# EAGLE board argon-v1.00 (EAGLE 9.0.1), part 1 of 2
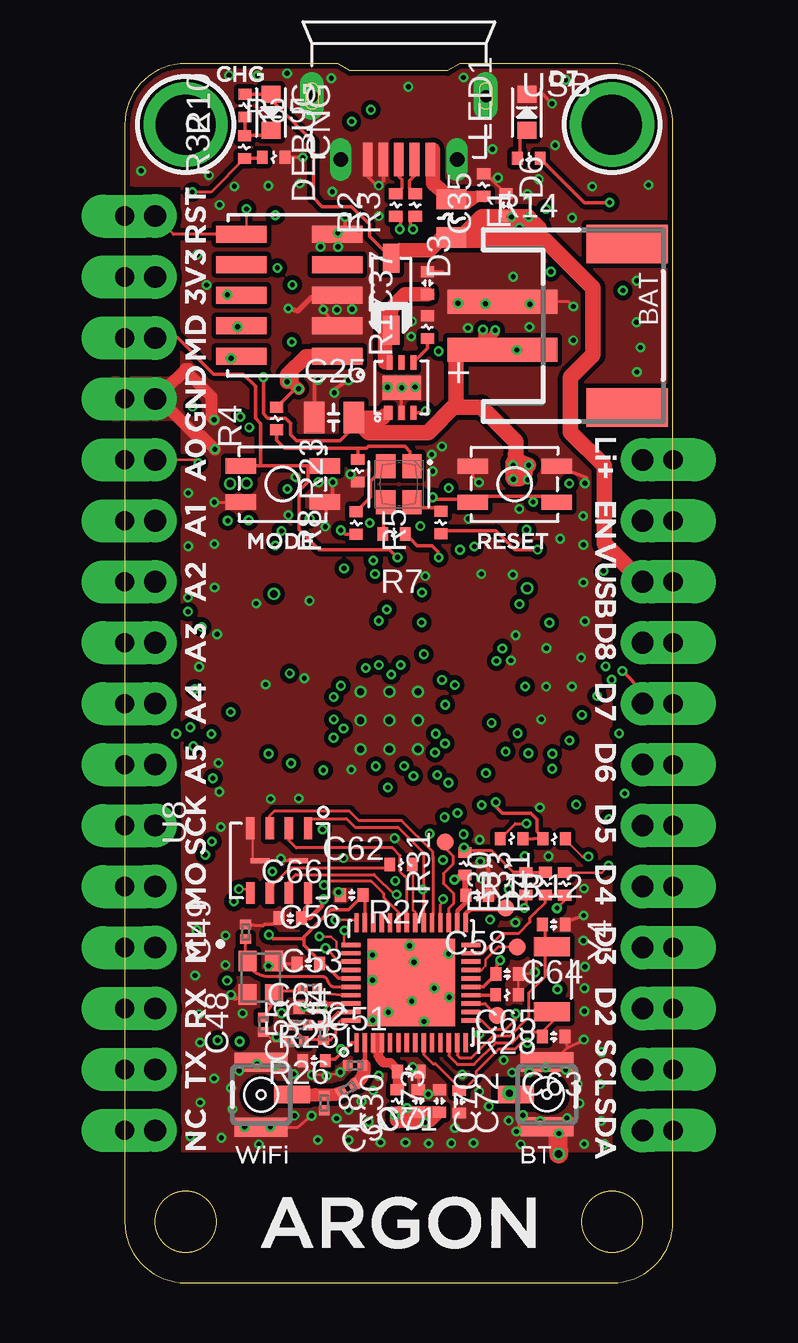
[diagram p2: board, top side]
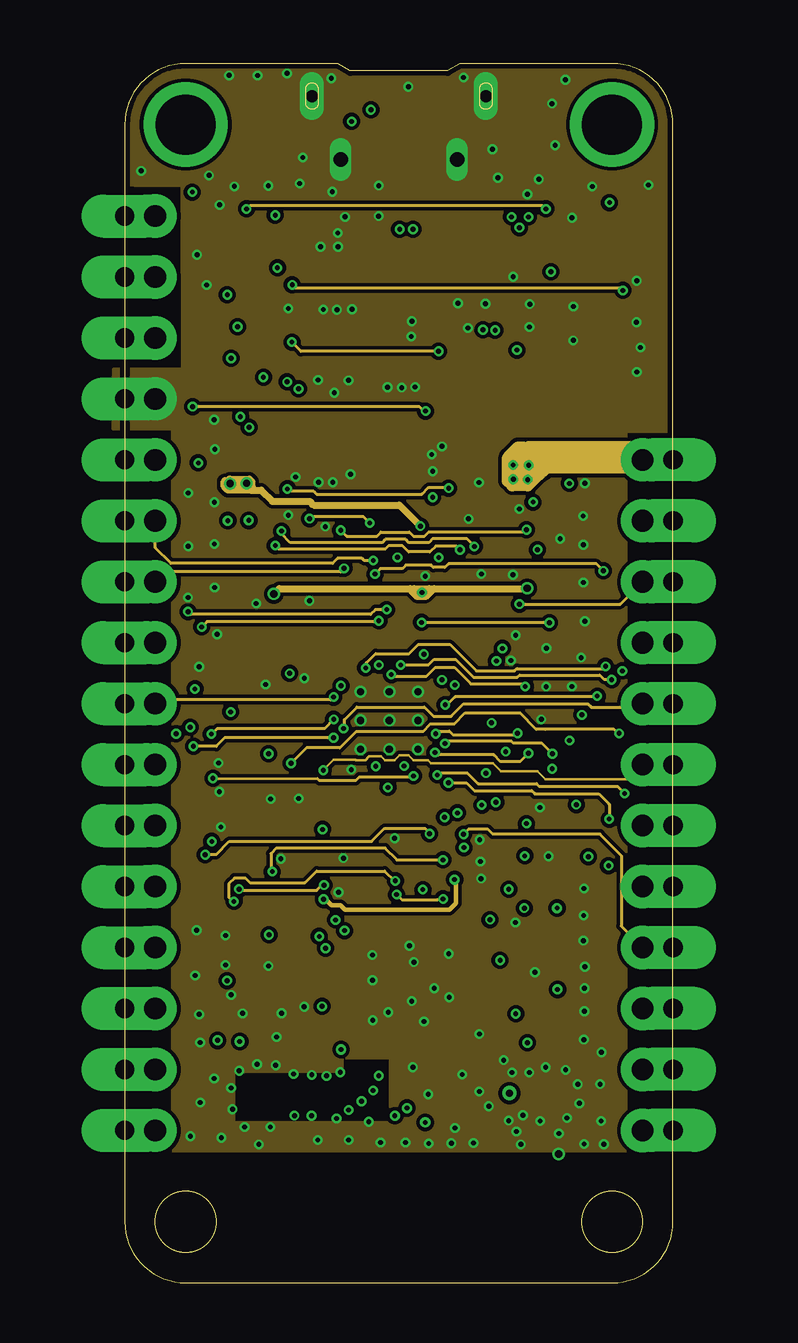
[diagram p3: board, inner layer Route2]
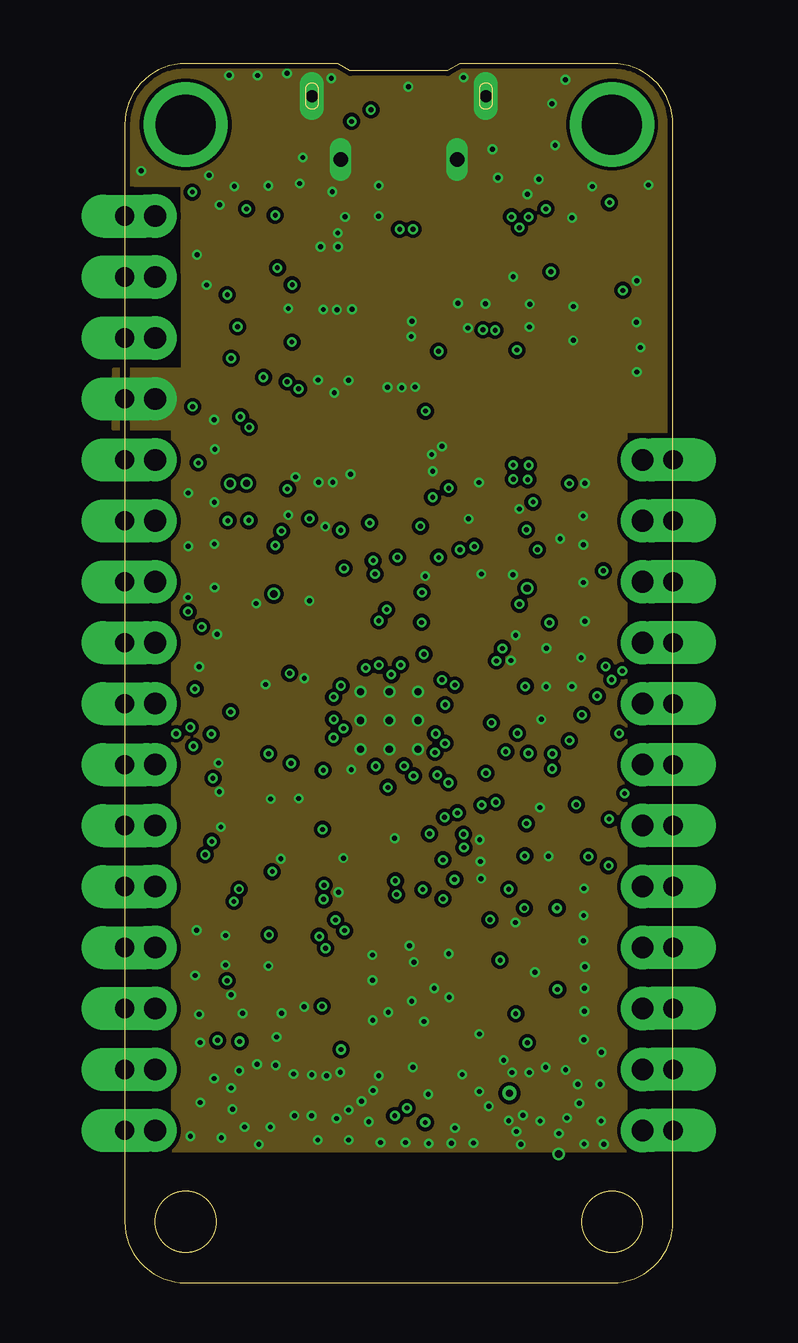
[diagram p4: board, inner layer Route3]
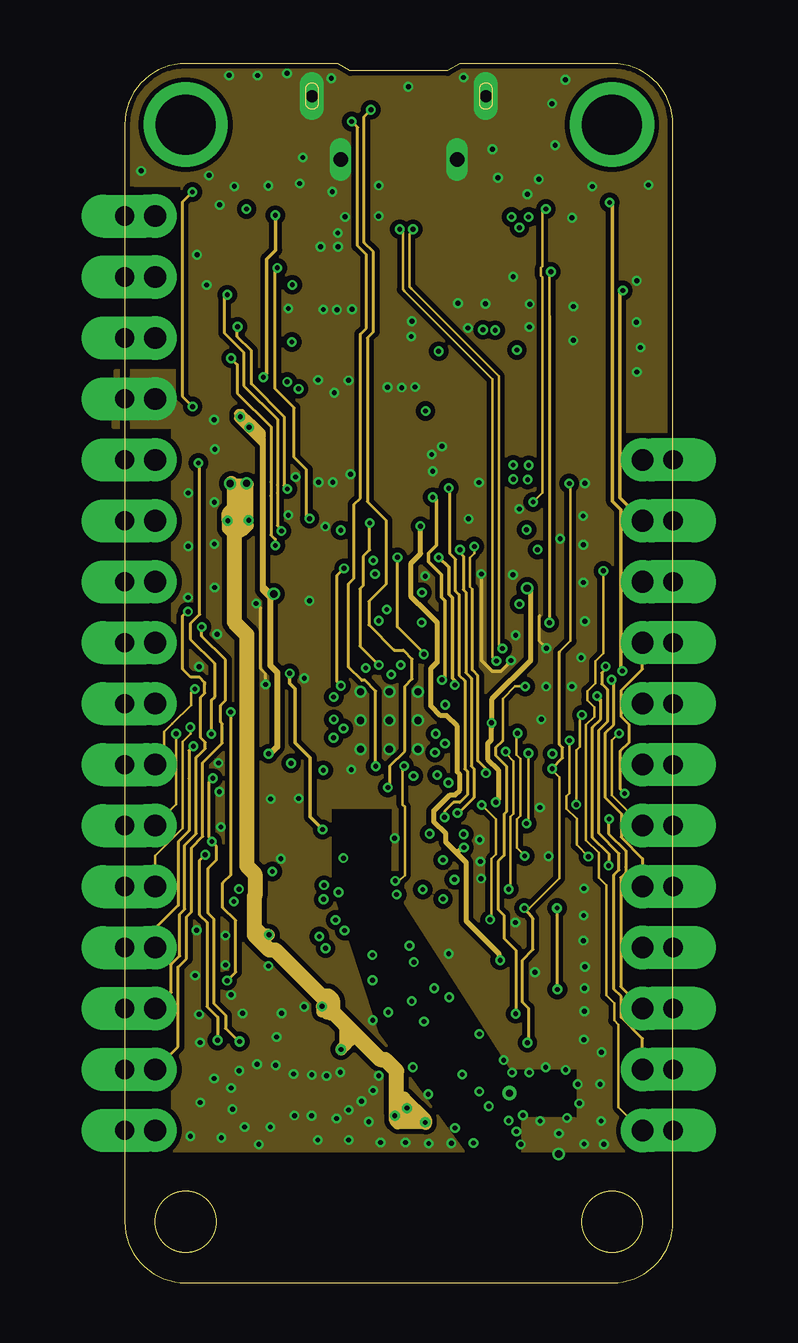
[diagram p5: board, inner layer Route4]
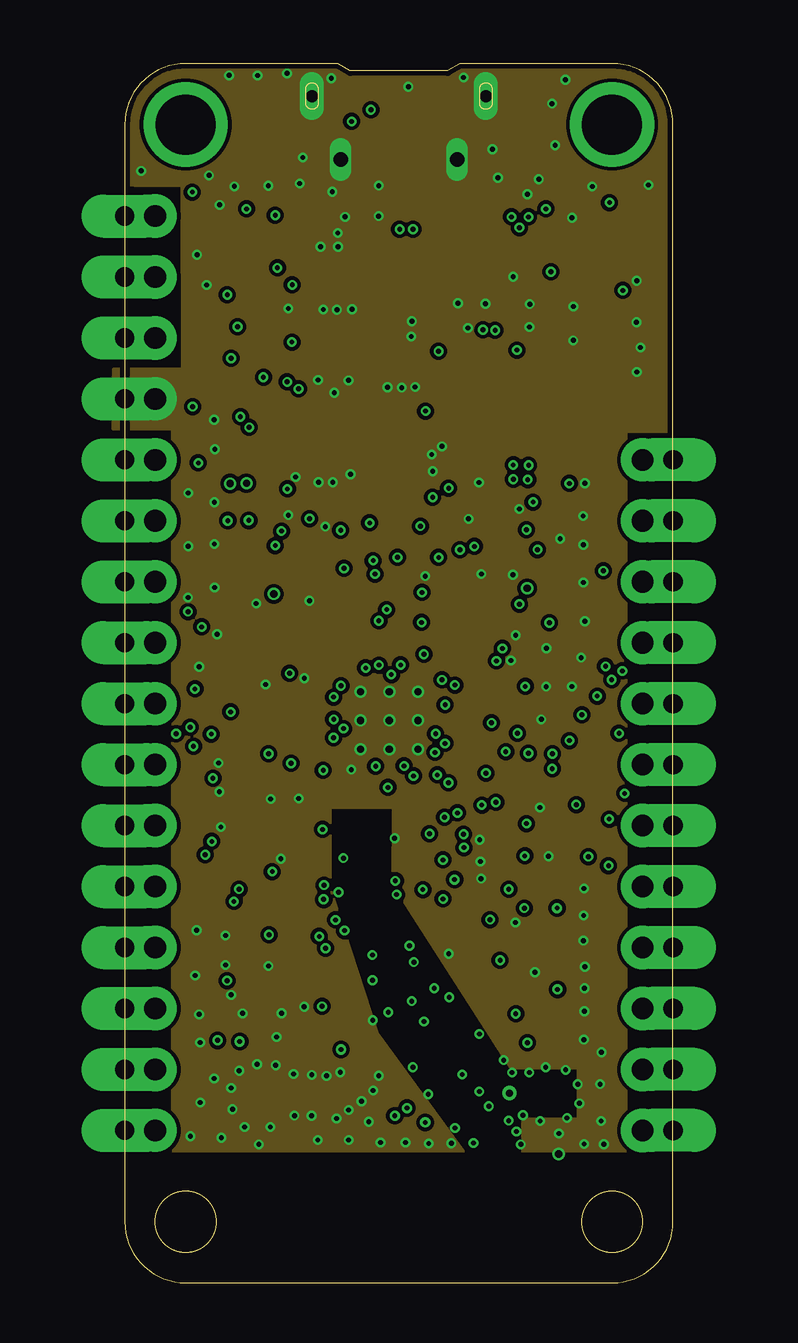
[diagram p6: board, inner layer Route15]
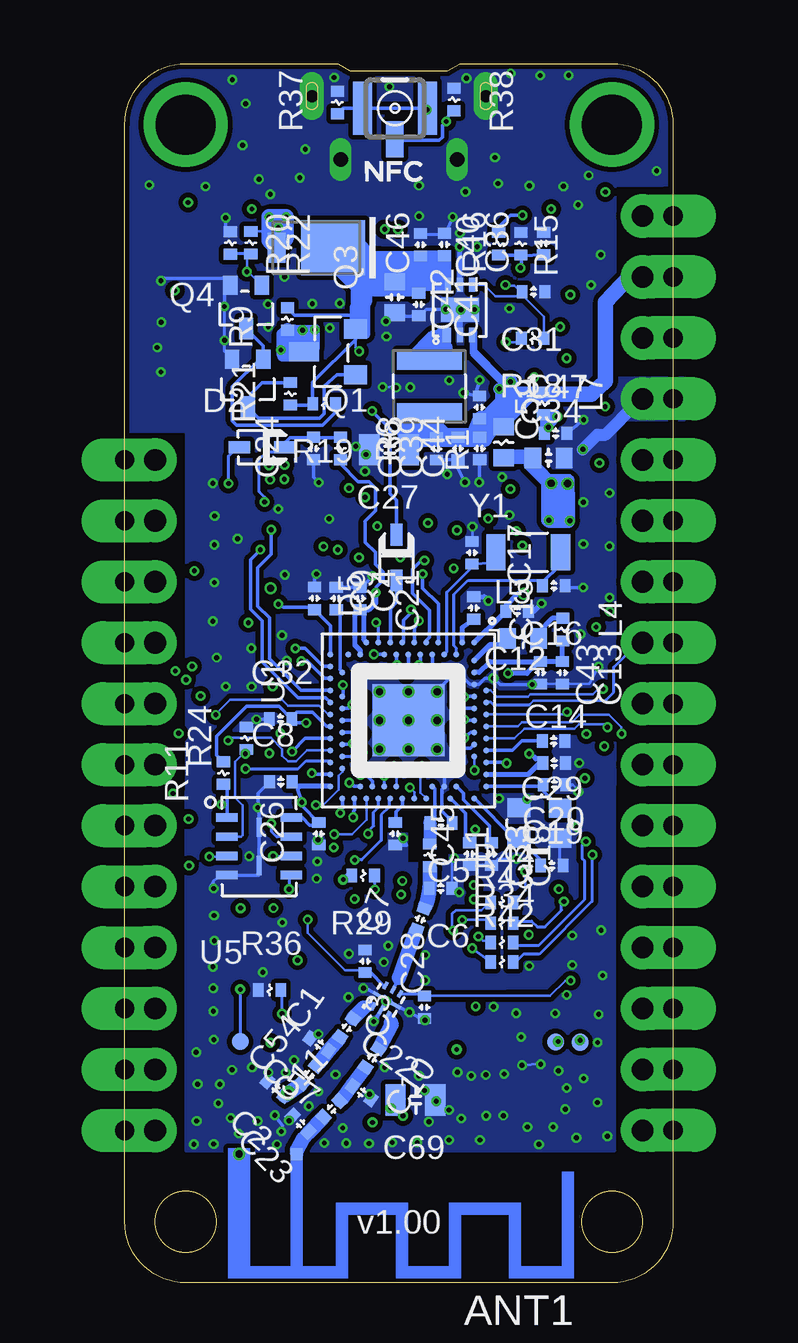
[diagram p7: board, bottom side, seen from below]

Size 22.86 x 50.8 mm. Coordinates in mm from the lower left corner, seen from the top.
Outline: 0,48.26 0,2.54 arc90 2.54,0 20.32,0 arc90 22.86,2.54 22.86,48.26 arc90 20.32,50.8 13.97,50.8 13.46,50.5 9.4,50.5 8.89,50.8 2.54,50.8 arc90 0,48.26
Outline: circle at 20.32,2.54 radius 1.27
Outline: circle at 2.54,2.54 radius 1.27
Copper layers (1+2*3+4*15+16): Top 0.035mm / dielectric 0.2mm / Route2 0.035mm / dielectric 0.15mm / Route3 0.035mm / dielectric 0.3mm / Route4 0.035mm / dielectric 0.15mm / Route15 0.035mm / dielectric 0.2mm / Bottom 0.035mm
Design rules "default *": minimum track width 4mil, minimum drill 0.2mm, track to track 6mil, track to pad 6mil, pad to pad 6mil, via to via 6mil, smd to smd 4mil, copper to edge 8mil, drill to drill 12mil, minimum pad ring 4mil, minimum via ring 4mil, stop-mask expansion 0.01mm, vias tented up to drill 16mil, thermal gap 4mil

## Footprints (pad centres in the part's own frame; a part is rotated, then mirrored left to right if it is on the bottom)
ANTENNA_F_PCB = drill 0.305: GND -1.55,-2.47 | smd 0.5 x 0.5: RF -3.95,-2.45
CON_2.0MM_SMT = smd 1 x 4.6: 1 -1,-2.933; 2 1,-2.933 | smd 1.6 x 3.4: NC1 -3.4,2.267; NC2 3.4,2.267
TS-1185A-020 = smd 1.27 x 0.635: 1 -1.75,0.752; 2 1.75,0.752; 3 -1.75,-0.752; 4 1.75,-0.752
C-0402 = smd 0.45 x 0.55: 1 -0.47,0; 2 0.47,0
C0805 = smd 0.85 x 1.3: 1 -0.8,0; 2 0.85,0
C0201-N = smd 0.4 x 0.45: 1 -0.305,0; 2 0.305,0
C0603 = smd 0.7 x 0.85: 1 -0.65,0; 2 0.65,0
LED0603 = smd 0.7 x 0.8: 1 -0.75,0; 2 0.75,0
SOD-323 = smd 0.9 x 0.5: 1 -0.95,0; 2 0.95,0
SOD-123 = smd 1.2 x 0.7: 1 -1.5,0; 2 1.5,0
DIODE-DO-220AA(SMP) = smd 0.762 x 1.27: ANODE 2.349,0 | smd 2.667 x 2.3: CATHODE 0,0
R-0402S = smd 0.45 x 0.55: 1 -0.47,0; 2 0.47,0
CON5X2_1.27 = smd 0.7 x 2.1: 1 -2.54,-2; 2 -2.54,2; 3 -1.27,-2; 4 -1.27,2; 5 0,-2; 6 0,2; 7 1.27,-2; 8 1.27,2; 9 2.54,-2; 10 2.54,2
F0805 = smd 0.85 x 1.25: P$1 -0.8,0; P$2 0.8,0
HEADER_16P2.54 = drill 0.9 pad 1.8: 1 0,-19.05; 2 0,-16.51; 3 0,-13.97; 4 0,-11.43; 5 0,-8.89; 6 0,-6.35; 7 0,-3.81; 8 0,-1.27; 9 0,1.27; 10 0,3.81; 11 0,6.35; 12 0,8.89; 13 0,11.43; 14 0,13.97; 15 0,16.51; 16 0,19.05 | drill 0.8 pad 1.8 long: P$1 -1.27,-19.05; P$2 -1.27,-16.51; P$3 -1.27,-13.97; P$4 -1.27,-11.43; P$5 -1.27,-8.89; P$6 -1.27,-6.35; P$7 -1.27,-3.81; P$8 -1.27,-1.27; P$9 -1.27,1.27; P$10 -1.27,3.81; P$11 -1.27,6.35; P$12 -1.27,8.89; P$13 -1.27,11.43; P$14 -1.27,13.97; P$15 -1.27,16.51; P$16 -1.27,19.05
SIP-12 = drill 0.9 pad 1.8: 1 0,13.97; 2 0,11.43; 3 0,8.89; 4 0,6.35; 5 0,3.81; 6 0,1.27; 7 0,-1.27; 8 0,-3.81; 9 0,-6.35; 10 0,-8.89; 11 0,-11.43; 12 0,-13.97 | drill 0.8 pad 1.8 long: P$1 -1.27,13.97; P$2 -1.27,11.43; P$3 -1.27,8.89; P$4 -1.27,6.35; P$5 -1.27,3.81; P$6 -1.27,1.27; P$7 -1.27,-1.27; P$8 -1.27,-3.81; P$9 -1.27,-6.35; P$10 -1.27,-8.89; P$11 -1.27,-11.43; P$12 -1.27,-13.97
R-0603A = smd 0.7 x 0.85: 1 -0.65,0; 2 0.65,0
INDUCTOR-NR3015 = smd 0.8 x 2.7: 1 -1.1,0; 2 1.1,0
IPEX-20279-001E = smd 0.73 x 1.5: 1 0,1.28 | smd 0.8 x 2.2: 2@1 -1.35,0; 2@2 1.35,0
SOT323 = smd 0.6 x 0.8: 1 -0.65,-1; 2 0.65,-1 | smd 0.6 x 0.9: 3 0,1
SOT-23 = smd 0.8 x 0.95: 1 -0.95,-1; 2 0.95,-1 | smd 0.8 x 1.25: 3 0,1.15
SOT323' = smd 0.6 x 0.8: 1 -0.65,-0.95; 2 0.65,-0.95 | smd 0.6 x 0.9: 3 0,0.85
R0201-N = smd 0.4 x 0.45: 1 -0.305,0; 2 0.305,0
PLCC4-2MM-RGB = smd 1 x 0.8: BLUE -0.75,-0.55; CA 0.75,-0.55; GREEN -0.75,0.55; RED 0.75,0.55
TP-2.5 = drill 2.5 pad 3.2: 1 0,0
TP0.7MM = smd 0.7 x 0.7: P$1 0,0
AQN507X7X0.85_HA-74_V2 = smd 3 x 3: P$74 0,0 | drill 0.3 pad 0.5: P$75 -1.2,1.2; P$76 0,1.2; P$77 1.2,1.2; P$78 -1.2,0; P$79 0,0; P$80 1.2,0; P$81 -1.2,-1.2; P$82 0,-1.2; P$85 1.2,-1.2 | smd 0.25 x 0.25: P$A8 -1.25,3.25; P$A10 -0.75,3.25; P$A12 -0.25,3.25; P$A14 0.25,3.25; P$A16 0.75,3.25; P$A18 1.25,3.25; P$A20 1.75,3.25; P$A22 2.25,3.25; P$A23 2.75,3.25; P$AA24 3.25,-2.25; P$AB2 -2.75,-2.5; P$AC5 -2,-2.75; P$AC9 -1,-2.75; P$AC11 -0.5,-2.75; P$AC13 0,-2.75; P$AC15 0.5,-2.75; P$AC17 1,-2.75; P$AC19 1.5,-2.75; P$AC21 2,-2.75; P$AC24 3.25,-2.75; P$AD2 -2.75,-3.25; P$AD4 -2.25,-3.25; P$AD6 -1.75,-3.25; P$AD8 -1.25,-3.25; P$AD10 -0.75,-3.25; P$AD12 -0.25,-3.25; P$AD14 0.25,-3.25; P$AD16 0.75,-3.25; P$AD18 1.25,-3.25; P$AD20 1.75,-3.25; P$AD22 2.25,-3.25; P$AD23 2.75,-3.25; P$B1 -3.25,2.75; P$B3 -2.5,2.75; P$B5 -2,2.75; P$B7 -1.5,2.75; P$B9 -1,2.75; P$B11 -0.5,2.75; P$B13 0,2.75; P$B15 0.5,2.75; P$B17 1,2.75; P$B19 1.5,2.75; P$B24 3.25,2.75; P$C1 -3.25,2.25; P$D2 -2.75,2; P$D23 2.75,2; P$E24 3.25,1.75; P$F2 -2.75,1.5; P$F23 2.75,1.5; P$G1 -3.25,1.25; P$H2 -2.75,1; P$H23 2.75,1; P$J1 -3.25,0.75; P$J24 3.25,0.75; P$K2 -2.75,0.5; P$L1 -3.25,0.25; P$L24 3.25,0.25; P$M2 -2.75,0; P$N1 -3.25,-0.25; P$N24 3.25,-0.25; P$P2 -2.75,-0.5; P$P23 2.75,-0.5; P$R1 -3.25,-0.75; P$R24 3.25,-0.75; P$T2 -2.75,-1; P$T23 2.75,-1; P$U1 -3.25,-1.25; P$U24 3.25,-1.25; P$V23 2.75,-1.5; P$W1 -3.25,-1.75; P$W24 3.25,-1.75; P$Y2 -2.75,-2; P$Y23 2.75,-2
USP-6C = smd 0.6 x 0.35: P$1 -1.05,0.55 | smd 0.6 x 0.25: P$2 -1.05,0; P$3 -1.05,-0.5; P$4 1.05,-0.5; P$5 1.05,0; P$6 1.05,0.5 | smd 1 x 1.6: P$7 0,0
QFN48-5X5 = smd 0.8 x 0.18: 1 -2.5,2.275; 2 -2.5,1.925; 3 -2.5,1.575; 4 -2.5,1.225; 5 -2.5,0.875; 6 -2.5,0.525; 7 -2.5,0.175; 8 -2.5,-0.175; 9 -2.5,-0.525; 10 -2.5,-0.875; 11 -2.5,-1.225; 12 -2.5,-1.575; 13 -2.5,-1.925; 14 -2.5,-2.275; 25 2.5,-2.275; 26 2.5,-1.925; 27 2.5,-1.575; 28 2.5,-1.225; 29 2.5,-0.875; 30 2.5,-0.525; 31 2.5,-0.175; 32 2.5,0.175; 33 2.5,0.525; 34 2.5,0.875; 35 2.5,1.225; 36 2.5,1.575; 37 2.5,1.925; 38 2.5,2.275 | smd 0.18 x 0.8: 15 -1.575,-2.5; 16 -1.225,-2.5; 17 -0.875,-2.5; 18 -0.525,-2.5; 19 -0.175,-2.5; 20 0.175,-2.5; 21 0.525,-2.5; 22 0.875,-2.5; 23 1.225,-2.5; 24 1.575,-2.5; 39 1.575,2.5; 40 1.225,2.5; 41 0.875,2.5; 42 0.525,2.5; 43 0.175,2.5; 44 -0.175,2.5; 45 -0.525,2.5; 46 -0.875,2.5; 47 -1.225,2.5; 48 -1.575,2.5 | smd 3.65 x 3.65: 49 0,0
USON8-3X4 = smd 0.9 x 0.35: 1 -1.35,1.2; 2 -1.35,0.4; 3 -1.35,-0.4; 4 -1.35,-1.2; 5 1.35,-1.2; 6 1.35,-0.4; 7 1.35,0.4; 8 1.35,1.2 | smd 0.2 x 0.8: 9 0,0.8; 10 0,-0.8
MLPD-6-1X1 = smd 0.33 x 0.15: P$1 -0.5,0.35; P$3 -0.5,-0.35; P$4 0.5,-0.35; P$5 0.5,0; P$6 0.5,0.35 | smd 0.45 x 0.15: P$2 -0.44,0 | smd 0.15 x 0.45: P$7 0,-0.43; P$8 0,0.43
MICRO_USB = smd 0.4 x 1.4: 1 1.3,0.1; 2 0.65,0.1; 3 0,0.1; 4 -0.65,0.1; 5 -1.3,0.1 | drill 0.6 pad 0.75 long: 6 2.425,0.1 | drill 0.5 pad 1 long: 7 3.625,2.75; 8 -3.625,2.75 | drill 0.6 pad 0.65 long: 9 -2.425,0.1
CRY_3215 = smd 0.8 x 1.5: 1 -1.35,0; 2 1.35,0
CRY_2520 = smd 0.95 x 0.8: 1 -0.86,-0.63; 2 0.86,-0.63; 3 0.86,0.63; 4 -0.86,0.64
CRY_2016 = smd 0.85 x 0.75: 1 -0.7,-0.55; 2 0.7,-0.55; 3 0.7,0.55; 4 -0.7,0.55

## Placement (x,y rotation side)
ANT1  ANTENNA_F_PCB  [ANTENNA_F_PCB]  19.64,2.9 180 bottom
BAT  CON2P_SMT  [CON_2.0MM_SMT]  18.68,39.88 270 top
BUTTON  TS-1185A-020  [TS-1185A-020]  6.58,33.28 0 top
C1  10pF  [C-0402]  13.61,10.63 55 bottom
C2  NC  [C-0402]  16.55,8.1 140 bottom
C3  33pF  [C-0402]  10.37,11.48 90 bottom
C4  4.7uF  [C-0402]  14.04,28.52 270 bottom
C5  1pF  [C-0402]  9.68,19.16 180 bottom
C6  1pF  [C-0402]  9.69,16.44 180 bottom
C7  10pF  [C-0402]  10.53,15.15 70 bottom
C8  O.1uF  [C-0402]  16.35,20.88 0 bottom
C9  4.7uF  [C-0402]  14.95,28.52 270 bottom
C10  10pF  [C-0402]  12.55,9.37 235 bottom
C11  1nH  [C-0402]  14.23,7.25 45 bottom
C12  1uF  [C-0402]  6.5,27.98 180 bottom
C13  1uF  [C-0402]  4.61,25.42 270 bottom
C14  1uF  [C-0402]  4.96,21.66 0 bottom
C15  O.1uF  [C-0402]  8.31,28.12 270 bottom
C16  12pF  [C-0402]  4.97,29.04 180 bottom
C17  12pF  [C-0402]  8.38,30.42 270 bottom
C18  100pF  [C-0402]  7.57,17.86 270 bottom
C19  16pF  [C-0402]  4.95,20.76 180 bottom
C20  16pF  [C-0402]  5.05,17.39 0 bottom
C21  4.7uF  [C-0402]  13.05,28.52 270 bottom
C22  0.5pF  [C-0402]  12.98,7.93 325 bottom
C23  1pF  [C-0402]  15.53,6.63 135 bottom
C24  0.1uF  [C-0402]  14.98,34.76 90 bottom
C25  10uF  [C0805]  8.71,36.05 0 top
C26  O.1uF  [C-0402]  14.77,18.71 90 bottom
C27  22uF  [C0805]  11.81,34.71 180 bottom
C28  33pF  [C-0402]  12.84,13.4 270 bottom
C29  NC  [C-0402]  4.98,22.57 180 bottom
C30  1.5pF  [C0201-N]  8.32,7.49 270 top
C31  10nF  [C-0402]  5.82,41.29 180 bottom
C32  O.1uF  [C-0402]  16.36,23.49 0 bottom
C33  nc  [C-0402]  8.48,17.87 270 bottom
C34  10uF  [C0603]  5.19,34.37 0 bottom
C35  0.1uF  [C-0402]  15.9,44.91 90 top
C36  10nF  [C-0402]  5.39,43.31 90 bottom
C37  0.1uF  [C-0402]  12.62,41.66 90 top
C38  0.1UF  [C-0402]  9.86,34.75 90 bottom
C39  1000pF  [C-0402]  8.97,34.76 90 bottom
C40  0.1UF  [C-0402]  10.53,43.25 270 bottom
C41  1000pF  [C-0402]  10.6,40.76 270 bottom
C42  10uF  [C0603]  11.6,41.07 270 bottom
C43  47nF  [C-0402]  5.53,25.42 270 bottom
C44  100pF  [C-0402]  8.06,34.76 90 bottom
C45  820pF  [C-0402]  11.58,18.71 270 bottom
C46  100pF  [C-0402]  9.54,43.27 90 bottom
C47  0.1UF  [C-0402]  4.89,35.39 0 bottom
C48  22pF  [C0201-N]  5.78,10.76 90 top
C49  22pF  [C0201-N]  5.03,14.62 90 top
C50  2.4nH  [C0201-N]  9.3,8.09 210 top
C51  2.7pF  [C0201-N]  9.6,9.06 0 top
C52  O.1uF  [C-0402]  7.89,9.25 0 top
C53  1uF  [C-0402]  7.74,11.48 0 top
C54  10pF  [C-0402]  15.17,8.68 50 bottom
C55  3.3nF  [C0201-N]  8.29,10.42 90 top
C56  O.1uF  [C-0402]  7.65,13.3 0 top
C57  NC  [C-0402]  14.75,9.93 145 bottom
C58  1uF  [C-0402]  14.7,16.14 180 top
C59  33pF  [C-0402]  8.07,36.48 270 bottom
C61  10nF  [C0201-N]  7.16,10.05 0 top
C62  O.1uF  [C-0402]  9.47,16.16 0 top
C63  12pF  [C-0402]  17.88,10.26 180 top
C64  12pF  [C-0402]  17.89,14.93 180 top
C65  O.1uF  [C-0402]  15.95,12.87 180 top
C66  O.1uF  [C-0402]  6.91,15.2 0 top
C69  10uF  [C0805]  10.72,7.62 180 bottom
C70  O.1uF  [C-0402]  12.24,7.58 270 top
C71  O.1uF  [C-0402]  11.84,8.8 180 top
C72  1uF  [C-0402]  13.12,7.58 270 top
C73  47PF  [C-0402]  13.95,7.54 90 top
CNG  ORANGE  [LED0603]  6.1,48.77 270 top
D2  LRB551V  [SOD-323]  17.13,34.82 0 bottom
D3  B5819w  [SOD-123]  11.12,41.19 270 top
D4  ss3p  [DIODE-DO-220AA(SMP)]  14.18,43.13 180 bottom
D5  LRV551v  [SOD-323]  11.52,30.22 90 bottom
D6  ESD  [R-0402S]  14.97,45.74 270 top
DEBUG  CON5X2  [CON5X2_1.27]  6.86,41.15 90 top
F1  6V 1A  [F0805]  13.62,44.35 270 top
HEAD1  HEADER_16P  [HEADER_16P2.54]  1.27,25.4 0 top
HEAD2  SIP-12  [SIP-12]  21.59,20.32 180 top
L1  3.9nH  [R-0402S]  10.14,17.81 270 bottom
L3  10uH  [R-0603A]  6.25,26.85 0 bottom
L4  15nH  [R-0402S]  4.59,27.21 270 bottom
L5  NR3015T2R2M  [INDUCTOR-NR3015]  10.16,37.35 270 bottom
L7  15nH  [R-0402S]  5.4,36.64 270 bottom
L8  2nH  [R-0402S]  11.36,7.57 90 top
LED1  blue  [LED0603]  16.76,48.77 90 top
NFC  UFL  [IPEX-20279-001E]  11.59,48.93 180 bottom
Q1  2n7002  [SOT323]  17.73,37.48 180 bottom
Q3  PMOS  [SOT-23]  14.24,38.79 90 bottom
Q4  2n7002  [SOT323']  17.8,40.61 180 bottom
R1  0R  [R-0603A]  7.05,35.02 90 bottom
R2  0R  [R-0402S]  11.3,44.91 90 top
R3  0R  [R-0402S]  12.11,44.91 90 top
R4  0R  [R-0402S]  6.33,36.01 90 top
R5  1K  [R-0402S]  13.18,31.68 90 top
R6  10K  [R-0402S]  13.87,34.76 270 bottom
R7  1K  [R-0402S]  11.23,31.2 180 top
R8  1K  [R-0402S]  9.65,31.66 90 top
R9  200K  [R-0402S]  16.08,40.16 90 bottom
R10  3K  [R-0402S]  5.02,49.05 90 top
R11  nc  [R-0402S]  18.75,21.24 90 bottom
R12  nc  [R-0402S]  17.91,18.5 180 top
R13  nc  [R-0402S]  16.13,18.51 180 top
R14  1K  [R-0402S]  16.85,46.85 180 top
R15  806k 1%  [R-0402S]  7.27,43.3 270 bottom
R16  2M 1%  [R-0402S]  6.35,43.29 90 bottom
R17  2K  [R-0402S]  12.62,39.82 90 top
R18  200K  [R-0402S]  5.85,39.36 180 bottom
R19  100K  [R-0402S]  14.55,36.63 180 bottom
R20  10K  [R-0402S]  18.45,43.33 270 bottom
R21  806k  [R-0402S]  15.96,37.04 90 bottom
R22  5.6k  [R-0402S]  17.6,43.34 270 bottom
R23  nc  [R-0402S]  9.72,33.83 90 top
R24  nc  [R-0402S]  17.79,22.69 90 bottom
R25  0R  [R0201-N]  7.72,12.24 180 top
R26  20K  [R0201-N]  7.33,10.74 180 top
R27  100R  [R-0402S]  11.52,17.43 180 top
R28  10K  [R-0402S]  15.94,12 180 top
R29  10K  [R-0402S]  12.92,16.98 180 bottom
R30  100K  [R-0402S]  16.73,16.63 90 top
R31  0R  [R-0402S]  14.19,17.46 90 top
R32  1K  [R-0402S]  5,47.32 90 top
R33  10K  [R-0402S]  17.54,16.63 90 top
R34  0R  [R-0402S]  7.13,14.18 0 bottom
R35  6.2K  [R-0402S]  6.21,46.9 0 top
R36  10K  [R-0402S]  16.82,12.2 0 bottom
R37  ESD NC  [R-0402S]  13.99,49.18 90 bottom
R38  ESD NC  [R-0402S]  9.13,49.3 270 bottom
R41  0R  [R-0402S]  18.34,16.62 90 top
R42  499R  [R-0402S]  7.13,13.37 0 bottom
R43  0R  [R-0402S]  7.13,14.98 0 bottom
R44  0R  [R-0402S]  7.13,15.84 0 bottom
RESET  TS-1185A-020  [TS-1185A-020]  16.26,33.27 0 top
RF  UFL  [IPEX-20279-001E]  17.6,7.85 90 top
RF1  UFL  [IPEX-20279-001E]  5.69,7.84 270 top
RGB  RGB-LED-CLMVB-FKARGB  [PLCC4-2MM-RGB]  11.43,33.27 90 top
TP1  TPTP2.5  [TP-2.5]  20.32,48.26 0 top
TP2  TPTP2.5  [TP-2.5]  2.54,48.26 0 top
TP3  TP  [TP0.7MM]  4.9,10.04 0 bottom
TP4  TP  [TP0.7MM]  3.88,10.02 0 bottom
TP5  TP  [TP0.7MM]  15.54,11.14 0 top
TP6  TP  [TP0.7MM]  16.37,13.99 0 top
TP7  TP  [TP0.7MM]  15.88,15.62 0 top
TP8  TP  [TP0.7MM]  13.37,18.36 0 top
TP9  TP  [TP0.7MM]  18.05,10.05 0 bottom
U1  NRF52840V02  [AQN507X7X0.85_HA-74_V2]  11.03,23.43 270 bottom
U3  XC6208A42  [USP-6C]  11.54,37.3 90 top
U4  ESP32  [QFN48-5X5]  11.94,12.51 90 top
U5  MX25L3233FZBI  [USON8-3X4]  17.26,18.19 0 bottom
U6  XC9258  [USP-6C]  8.88,40.54 90 bottom
U8  MX25L3233FZBI  [USON8-3X4]  6.44,17.59 270 top
U$2  SKY13351-378LF  [MLPD-6-1X1]  11.93,11.78 60 bottom
USB  MICRO_USB_5P  [MICRO_USB]  11.43,46.7 0 top
Y1  32.768K 9P 20PPM  [CRY_3215]  6.03,30.44 0 bottom
Y2  32M 8P 10PPM  [CRY_2520]  5.57,19.15 0 bottom
Y3  40M 10PPM  [CRY_2016]  5.68,12.72 270 top
Y4  32.768K 12.5P  [CRY_3215]  17.82,12.65 270 top

## Tracks (layer width: path | path; a pad name or v marks a point on that pad's centre or on a via)
3.3V  (via drill 0.2 pad 0.4)
  Top 0.15: R4.2 7.1,37.25 v7.25,37.25
  Top 0.152: HEAD1.P$15 HEAD1.15
  Top 0.5: v7.25,37.25 7.03,37.47 7.03,38.01 7.22,38.21
  Top 0.6: v6.77,37.54 6.77,37.83 7.56,38.61 DEBUG.1
  Bottom 0.15: 11.35,34.38 C27.1 11.01,34.36 | C38.2 9.86,35.15 | R1.2 7.48,35.48 7.69,35.48 7.82,35.61 7.82,35.63 | C44.2 8.06,35.38 8.33,35.33 | 7.2,36.08 L7.1 7.22,36.08 7.23,36.07 | 10.83,36.06 10.74,36.15 | 10.74,36.15 10.74,36.19 | L5.2 10.64,36.25 10.74,36.15 | C59.2 8.03,36.05 7.99,36.05 | C39.2 9.03,35.17 9.03,35.15
  Bottom 0.2: 6.86,36.92 6.96,37.03 6.96,37.32 8.38,38.74 U6.P$3 | 8.33,35.33 8.46,35.46 8.46,35.51 10.03,35.51
  Bottom 0.3: 6.79,37.52 6.86,37.59 7.09,37.59 8.31,38.81 8.31,39.63
  Bottom 0.4: C39.2 9.27,35.23 9.81,35.77
  Bottom 0.5: 7.16,36.63 7.16,37.16 v7.25,37.25
  Bottom 0.6: C27.1 10.99,34.69 10.96,34.69 10.96,35.63 10.93,35.66 10.75,35.66 L5.2 11.18,36.25 11.19,36.23 11.19,35.36 10.98,35.15 | 7.87,35.15 7.22,36.06 7.23,36.07 | 7.23,36.07 7.25,36.05 7.99,36.05 8.07,35.97 8.33,35.33 7.82,35.63 7.6,35.86 7.23,36.07 | 7.23,36.07 7.22,36.07 | v6.77,37.54 6.79,37.52 6.79,36.99 6.86,36.92
  Bottom 0.65: 10.98,35.15 9.86,35.15 9.03,35.15 7.87,35.15 | 7.6,35.86 7.6,36.18 7.16,36.63 6.86,36.92 6.69,36.92 6.59,37.02 5.98,37.02 | HEAD1.15 1.77,41.91 1.8,41.93 2.81,40.86 2.81,37.57 3.41,37.02 5.98,37.02 | L5.2 10.11,36.2 9.77,36.2 9.77,36.15 10.59,35.34 10.63,35.34 | C27.1 10.99,34.71 10.48,35.22 | R1.2 6.91,36.09 5.98,37.02
/CHG
  Bottom 0.15: U1.P$R1 11.78,28.09 11.52,28.35 D5.1
/REST  (via drill 0.2 pad 0.4)
  Top 0.11: DEBUG.10 5.08,43.91 v5.08,44.74
  Top 0.12: DEBUG.10 2.03,43.69 HEAD1.16
  Top 0.15: RESET.3 14.37,32.52 14.24,32.66 12.91,32.66 v12.84,32.73 | 14.56,32.47 RESET.3 | RESET.4 18.01,32.57 17.82,32.77 17,32.77 | RESET.3 14.75,32.77 17,32.77 | 17,32.77 17,32.55 v17.03,32.53
  Top 0.152: HEAD1.P$16 HEAD1.16
  Route2 0.12: v5.08,44.74 5.23,44.9 6.45,44.9 17.41,44.9 v17.56,44.74
  Route4 0.11: v17.56,44.74 17.42,44.6 17.42,42.36 17.36,42.3 17.36,41.96 17.42,41.89 17.42,32.93 v17.03,32.53
  Route4 0.15: v12.84,32.73 12.85,32.72 12.9,32.72 13,32.62 13,30.74 12.66,30.4 12.66,30.04 13.21,29.5 13.21,28.57 13.36,28.43 13.36,25.12 v13.23,25.12
  Bottom 0.11: 16.45,34.83 D2.2
  Bottom 0.12: v17.03,32.53 17.03,32.74 17.25,32.96 17.25,34.24 17.25,34.31 16.93,34.63 16.64,34.63 16.45,34.83
  Bottom 0.15: D2.2 16.42,34.91 16.27,34.91 15.97,35.21 14.99,35.21 | 13.84,35.21 13.73,35.1 | 13.84,35.21 13.85,35.21 R6.1 | 14.99,35.21 13.84,35.21 | U1.P$AC13 13.26,23.43 12.81,23.88 12.81,24.46 13.2,24.85 v13.23,25.12 | C24.2 14.99,35.21
A0  (via drill 0.2 pad 0.4)
  Top 0.11: v3.07,34.16 2.94,34.29 HEAD1.12
  Top 0.152: HEAD1.P$12 HEAD1.12
  Route2 0.12: v8.71,23.48 8.33,23.1 3.86,23.1 3.63,22.86 v3.61,22.86
  Route4 0.12: v3.61,22.86 3.61,24.28 3.74,24.41 3.74,25.81 2.73,26.82 2.73,27.45 3.13,27.85 3.13,34.1 v3.07,34.16
  Bottom 0.15: U1.P$B13 8.55,23.43 8.56,23.43 8.66,23.43 v8.71,23.48
A1  (via drill 0.2 pad 0.4)
  Top 0.152: HEAD1.P$11 HEAD1.11
  Route2 0.12: v10.36,30.1 9.98,30.1 9.89,30.18 8.87,30.18 8.66,29.97 1.93,29.97 1.27,30.63 HEAD1.11
  Bottom 0.15: U1.P$J1 10.28,26.78 10.16,26.9 10.16,28.01 10.87,28.72 10.87,29.74 10.51,30.1 v10.36,30.1
A2  (via drill 0.2 pad 0.4)
  Top 0.152: HEAD1.P$10 HEAD1.10
  Route2 0.12: v9.14,29.77 9,29.62 1.69,29.62 HEAD1.10
  Route4 0.12: v9.01,24.88 8.86,25.04 8.86,29.48 v9.14,29.77
  Route4 0.15: 9.09,29.71 v9.14,29.77 | 9.09,24.83 v9.01,24.88
  Bottom 0.15: U1.P$B11 9,23.93 9.16,24.09 9.16,24.74 v9.01,24.88
A3
  Top 0.152: HEAD1.P$9 HEAD1.9
  Bottom 0.11: 5.98,24.09 5.81,24.26 2.83,24.26 2.8,24.28
  Bottom 0.12: U1.P$A10 7.58,24.18 7.49,24.09 5.98,24.09 | 2.8,24.28 2.47,24.62 2.47,25.66 1.53,26.59 1.35,26.59 HEAD1.9
A4  (via drill 0.2 pad 0.4)
  Top 0.152: HEAD1.P$8 HEAD1.8
  Route2 0.12: v8.71,24.41 8.6,24.29 1.43,24.29 HEAD1.8
  Bottom 0.15: U1.P$B9 8.7,24.43 v8.71,24.41
A5  (via drill 0.2)
  Top 0.152: HEAD1.P$7 HEAD1.7
  Route4 0.11: HEAD1.7 1.65,21.97 1.65,22.96 1.98,23.29 1.99,23.29 2.76,24.06 2.76,24.58 v2.93,24.74
  Route4 0.12: 1.25,21.61 HEAD1.7 1.25,21.57
  Route4 0.152: 1.25,21.57 1.25,21.6
  Bottom 0.11: U1.P$A8 7.61,24.68 7.34,24.42 6.04,24.42 5.94,24.52 3.34,24.52 3.11,24.74 v2.93,24.74
B_RX  (via drill 0.2 pad 0.4, 0.2 pad 0.42)
  Route2 0.12: v3.36,17.84 3.81,17.84 4.36,18.39 10.29,18.39 10.84,18.94 12.52,18.94 12.71,18.75 v12.71,18.71
  Route4 0.12: v3.36,17.84 v3.35,17.84 3.13,17.62 3.13,15.32 3.43,15.02 3.43,11.51 3.88,11.07 v3.88,10.1
  Bottom 0.11: 6.58,13.45 R42.2 | 12.31,20.15 U1.P$U24 | TP4.P$1 3.87,9.99
  Bottom 0.12: v3.36,17.84 v3.35,17.83 3.33,17.83 3.38,17.78 3.38,15.9 5.58,13.7 6.23,13.7 6.48,13.45 6.58,13.45 | 3.87,9.99 3.94,10.05 3.85,10.12 3.78,10.1 4.13,10.09 3.65,10.09 v3.88,10.1 | v12.71,18.71 12.71,18.81 12.49,19.04 12.49,19.61 12.28,19.82 12.28,20.12 12.31,20.15
B_TX  (via drill 0.2 pad 0.4, 0.2 pad 0.42)
  Route2 0.12: v3.68,21.02 8.04,21.01 8.1,20.94 9.64,20.94 9.78,21.08 11.94,21.08 11.97,21.12 v12.04,21.12
  Route4 0.11: 3.67,20.95 v3.68,21.02
  Route4 0.12: v4.79,10.05 4.75,10.06 4.2,10.6 4.2,11.15 3.72,11.63 3.72,15.15 3.48,15.4 3.48,17.27 3.83,17.62 3.83,18.19 v3.63,18.39 3.63,18.47 3.53,18.57 3.53,20.87 v3.68,21.02
  Bottom 0.11: 4.74,10.05 v4.79,10.05 TP3.P$1
  Bottom 0.12: U1.P$T23 12.03,21.06 | 12.03,21.06 12.03,21.07 | R34.2 6.55,14.07 5.59,14.07 3.68,15.97 3.68,17.58 3.77,17.67 3.77,18.25 v3.63,18.39 | 12.03,21.06 v12.04,21.12
  Bottom 0.152: TP3.P$1 arc-90 4.79,9.99 v4.79,10.05
BAT_DET  (via drill 0.2 pad 0.4)
  Route2 0.12: v10.21,31.66 9.95,31.93 7.85,31.93 7.69,31.77 v7.71,31.84
  Route4 0.12: v10.21,31.66 10.21,30.54 9.95,30.27 9.95,29.05 9.81,28.91 9.81,26.53 v10.6,25.74 | v7.71,31.84 7.59,31.96 7.58,31.96 7.58,33.88 7.07,34.39 7.07,36.45 6.27,37.25 6.27,42.19 v6.37,42.29
  Bottom 0.15: R15.2 R16.1 6.32,42.79 C36.1 | U1.P$K2 10.53,25.75 v10.6,25.74
  Bottom 0.152: 6.32,42.79 6.32,42.47 v6.37,42.29
BLUE  (via drill 0.2)
  Top 0.15: v17.21,30.55 16.27,30.55 15.49,31.34 13.31,31.34 R5.1
  Bottom 0.15: U1.P$AD10 14.48,24.38 15.63,24.38 17.13,25.89 17.13,27.59 17.61,28.07 17.61,30.12 17.24,30.49 17.15,30.49 v17.2,30.55 v17.21,30.55
BOOT  (via drill 0.2 pad 0.42)
  Top 0.11: 18.36,16.31 R41.1
  Top 0.12: U4.23 14.91,13.73 15.75,14.57 16.43,14.57 16.9,15.04 16.9,15.21 17.11,15.41 17.53,15.83 17.53,15.9 17.53,16 17.53,16.23 17.54,16.22 R33.1 R41.1 18.34,15.93 v18.02,15.62
  Top 0.15: 17.53,16.23 17.53,16.2
  Route4 0.12: v18.02,15.62 18.02,12.24 v18.04,12.22
  Bottom 0.12: v18.04,12.22 18.04,10.32 TP9.P$1
BOOT_W  (via drill 0.2 pad 0.4)
  Top 0.11: v20.17,17.38 19.88,17.09 R41.2
  Route2 0.12: v19.7,24.45 19.66,24.45 19.63,24.42 13.77,24.42 13.44,24.08 v13.36,24.08
  Route4 0.11: v19.7,24.45 19.85,24.17 19.85,23.49
  Route4 0.12: v20.17,17.38 20.19,17.53 20.19,17.87 19.5,18.55 19.5,23.14 19.84,23.48 19.84,24.3 v19.7,24.45
  Bottom 0.15: v13.36,24.08 13.51,23.93 U1.P$AC11
BT_CTS  (via drill 0.2 pad 0.4)
  Route2 0.12: v13.27,17.62 11.35,17.62 10.86,18.11 6.32,18.11 6.1,17.89 6.1,17.19 v6.15,17.14
  Bottom 0.11: R44.2 6.15,16.36 v6.15,17.14
  Bottom 0.12: U1.P$R24 11.84,20.13 11.84,19.82 12.17,19.5 12.17,18.44 12.99,17.62 v13.27,17.62
BT_RTS  (via drill 0.2 pad 0.4)
  Route2 0.12: v4.55,15.89 4.51,15.89 4.33,16.06 4.33,16.62 4.58,16.86 5.03,16.86 5.22,16.67 7.52,16.67 8,17.15 10.84,17.15 11.24,16.75 v11.28,16.75
  Route4 0.11: v11.28,16.75 11.44,16.75 11.68,16.99 11.68,19.83 11.59,19.92 11.59,21.42 v11.65,21.54
  Bottom 0.11: U1.P$P23 11.53,21.36 v11.65,21.54
  Bottom 0.12: R43.2 6.57,15.07 5.9,15.07 5.66,14.83 5.34,14.83 4.64,15.53 4.64,15.79 v4.55,15.89
CH  (via drill 0.2 pad 0.4)
  Top 0.12: v2.82,45.45 3.6,45.45 R32.1
  Top 0.15: R32.1 5.75,46.85 5.8,46.89 5.77,46.92 5.75,46.92 R35.1 5.84,46.8 | U3.P$3 12.48,36.25 v12.54,36.32
  Route2 0.12: v12.54,36.32 12.47,36.32 12.29,36.5 2.84,36.5 v2.83,36.51
  Route4 0.12: v2.82,45.45 2.4,45.02 2.4,36.94 v2.83,36.51
  Bottom 0.15: v12.54,36.32 11.8,35.58 11.8,32.88 11.53,32.61 11.53,31.48 11.54,31.47 D5.2
D2  (via drill 0.2 pad 0.4)
  Top 0.152: HEAD2.P$3 HEAD2.3
  Route2 0.12: v13.5,20.84 14.25,20.84 14.57,20.51 16.96,20.51 17.1,20.37 19.76,20.37 20.2,19.93 v20.2,19.32
  Route4 0.11: 20.17,19.29 v20.2,19.32
  Route4 0.12: 20.17,19.29 20.17,18.71 20.88,18 20.88,17.33 20.88,17.09 20.68,16.88 20.68,12.34 HEAD2.3
  Bottom 0.15: U1.P$Y23 13.29,20.68 v13.5,20.84
D3  (via drill 0.2 pad 0.4)
  Top 0.152: HEAD2.P$4 HEAD2.4
  Route2 0.12: HEAD2.4 20.7,14.86 20.7,17.8 19.81,18.69 15.35,18.69 15.15,18.89 14.33,18.89 v14.13,18.69
  Bottom 0.11: U1.P$W24 12.78,19.3 13.39,18.69 v14.13,18.69
D4  (via drill 0.2 pad 0.4)
  Top 0.152: HEAD2.P$5 HEAD2.5
  Route2 0.12: v11.51,25.74 12.66,25.74 12.9,25.97 13.8,25.97 14.55,25.22 16.37,25.22 16.47,25.32 19.8,25.32 19.97,25.16 20.27,25.16 v20.3,25.13
  Route4 0.12: HEAD2.5 21.59,17.68 20.7,18.57 20.7,19.55 20.05,20.2 20.05,22.92 20.39,23.26 20.39,25.04 v20.3,25.13
  Bottom 0.15: U1.P$P2 11.53,25.79 v11.51,25.74
D5  (via drill 0.2 pad 0.4)
  Top 0.152: HEAD2.P$6 HEAD2.6
  Route2 0.12: v20.61,22.89 20.56,22.89 20.39,23.07 17.54,23.07 17.54,23.06 17.15,23.06 16.47,23.75 14.2,23.75 13.74,23.29 12.74,23.29 12.43,22.97 9.65,22.97 8.97,22.28 7.58,22.28 v6.94,21.64
  Route4 0.11: v20.61,22.89 20.32,22.6 20.32,20.31 21.58,19.05 HEAD2.6
  Bottom 0.15: U1.P$A20 6.97,21.68 v6.94,21.64
D6  (via drill 0.2 pad 0.4)
  Top 0.152: HEAD2.P$7 HEAD2.7
  Route2 0.11: v8.28,21.35 8.71,21.79 9.63,21.79 9.64,21.77 10.04,21.77 10.2,21.93 10.69,21.93 10.84,21.77 11.25,21.77 11.46,21.98 11.84,21.98 12.04,21.77 12.65,21.77 12.78,21.64 14.26,21.64 15.36,21.64 15.69,21.32 17.21,21.32 17.55,20.98 20.98,20.98 HEAD2.7
  Bottom 0.11: U1.P$B19 v8.28,21.36 v8.28,21.35
D7  (via drill 0.2 pad 0.4)
  Top 0.15: v20.75,25.5 21.59,24.65 HEAD2.8 | v20.21,45.01 19.16,45.01 R14.1
  Top 0.152: HEAD2.P$8 HEAD2.8
  Route2 0.12: v9.12,23.09 9.16,23.13 9.16,23.46 9.68,23.98 12.5,23.98 12.88,23.6 13.6,23.6 14.13,24.12 19.3,24.12 19.45,23.98 21.44,23.98 HEAD2.8
  Route4 0.15: v20.75,25.5 20.69,25.55 20.69,26.29 20.69,26.3 20.69,32.2 20.33,32.56 20.33,44.89 v20.21,45.01
  Bottom 0.15: U1.P$B17 8.45,22.27 8.89,22.27 9.15,22.52 9.15,23.06 v9.12,23.09
D8  (via drill 0.2 pad 0.4)
  Top 0.152: HEAD2.P$9 HEAD2.9
  Route2 0.12: v13.03,21.16 13.07,21.25 14.28,21.25 14.73,20.8 17.16,20.8 17.28,20.69 20.55,20.69 v20.84,20.39
  Route4 0.12: v20.84,20.39 20.67,20.57 20.67,22.16 21.03,22.52 21.03,23.26 20.7,23.59 20.7,24.68 21.59,25.57 HEAD2.9
  Bottom 0.15: U1.P$V23 12.53,20.9 12.79,21.16 v13.03,21.16
D+
  Top 0.13: R2.2 11.3,45.34 11.31,45.34 11.57,45.61 11.57,45.94
  Top 0.15: USB.3 11.43,46.09 11.57,45.95 11.57,45.61 11.39,45.43 11.31,45.43 11.27,45.39 11.29,45.39 R2.2
D-
  Top 0.13: 11.86,45.64 11.86,45.92 12.08,46.14 USB.2
  Top 0.15: R3.2 11.87,45.63 11.87,45.92 12.08,46.13 12.08,46.14
ENABLE  (via drill 0.2 pad 0.4)
  Top 0.152: HEAD2.P$11 HEAD2.11
  Route2 0.12: v6.99,41.58 7.11,41.46 20.66,41.46 v20.77,41.35
  Route4 0.15: HEAD2.11 20.64,32.7 20.64,41.21 v20.77,41.35
  Bottom 0.11: C31.2 6.33,41.37 6.42,41.37 6.61,41.55 6.96,41.55 v6.99,41.58 | R18.1 5.38,40.26 6.3,41.18 C31.2 | C31.2 6.47,41.1 7.4,41.1 7.89,41.59 U6.P$4
  Bottom 0.15: U6.P$4 8.38,41.65
F_/HOLD  (via drill 0.2 pad 0.4)
  Top 0.12: R13.2 16.29,19.14 v16.75,19.14
  Route2 0.12: v16.83,22.07 16.48,21.72 15.67,21.72 15.39,22 13.06,22 12.98,22.08 v12.94,22.1
  Route4 0.11: v16.75,19.14 16.73,19.16 16.83,19.25 v16.83,22.07
  Bottom 0.12: U1.P$AC19 13.07,21.93 v12.94,22.1 | U5.7 16.52,18.59 16.73,18.8 16.73,19.16
  Bottom 0.15: 16.73,19.16 v16.75,19.14
F_/WP  (via drill 0.2 pad 0.4)
  Top 0.11: R12.1 18.49,18.44 18.49,18.34 18.5,18.34 19.09,17.76 v19.33,17.76
  Route4 0.11: v19.33,17.76 18.84,18.25 18.84,19.33 18.42,19.75 18.42,20.27 18.55,20.39 v18.55,22.59
  Bottom 0.11: U5.3 18.64,17.76 v19.33,17.76 | v18.55,22.59 18.43,22.71 16.76,22.71 16.29,22.24 16.29,21.96 16.05,21.72 15.72,21.72 15.26,22.18 U1.P$AD18
F_CLK  (via drill 0.2 pad 0.4)
  Route2 0.12: v12.96,22.87 12.98,22.87 13.1,22.99 13.54,22.99 13.68,22.84 16.32,22.84 v16.38,22.9
  Route3 0.11: v12.96,22.87 12.99,22.9
  Route4 0.11: v16.38,22.9 16.32,22.85 16.32,22 16.49,21.83 16.49,19.45 16.34,19.3 16.34,18.12 v16.68,17.79
  Bottom 0.11: U5.6 16.64,17.78 v16.68,17.79
  Bottom 0.15: U1.P$AC15 13.05,22.93 v12.96,22.87
F_CS  (via drill 0.2 pad 0.4)
  Route4 0.11: v19.06,23.66 19.06,23.52 18.98,23.43 18.98,22.34 18.83,22.2 v18.83,19.93 v18.83,19.92
  Bottom 0.11: U1.P$AD12 14.38,23.68 14.75,24.05 16.06,24.05 16.31,24.3 18.46,24.3 19.06,23.7 v19.06,23.66 | R11.1 18.68,20.7 | 18.68,20.7 18.61,20.63 18.61,19.85 | 18.61,19.85 U5.1 18.57,19.42 18.57,20.55 18.68,20.66 18.68,20.7 | 18.61,19.85 18.63,19.88 v18.83,19.92
F_SI  (via drill 0.2 pad 0.4)
  Route4 0.11: v16.01,16.4 16.05,16.4 16.08,16.44 16.08,19.41 16.21,19.54 16.21,21.74 15.88,22.07 v15.88,22.13
  Bottom 0.11: U5.5 16.24,16.99 16.25,16.98
  Bottom 0.12: U5.5 arc-90 16.01,16.88 v16.01,16.4
  Bottom 0.15: 16.07,16.89 16.07,16.99 | 16.07,17.02 16.07,16.99 | 16.07,16.99 16.05,16.97 | 16.09,16.99 U5.5 | 16.18,16.96 16.15,16.99 16.09,16.99 | U5.5 15.94,16.95 16.05,16.95 | 16.05,16.95 16.27,16.95 | v15.88,22.13 15.34,22.68 U1.P$AD16 | 16.09,16.99 16.05,16.95 | U5.5 16.07,16.99 | 16.07,16.99
F_SO  (via drill 0.2 pad 0.4)
  Route2 0.12: v17.83,22.04 17.39,22.49 16.55,22.49 16.2,22.49 16.12,22.57 13.45,22.57 v13.35,22.47
  Bottom 0.11: U5.2 18.02,18.59 17.95,18.65 17.95,19.89 18.27,20.21 18.27,21.72 17.87,22.12 v17.83,22.04
  Bottom 0.15: U1.P$AC17 13.41,22.43 v13.35,22.47
  Bottom 0.2: R24.1 17.87,22.14 17.87,22.12
GND  (via drill 0.2 pad 0.4)
  Top 0.11: C62.1 8.85,16 v8.92,16.28 | U8.4 5.34,18.84 5.34,17.7 5.45,17.59 5.79,17.59 | C61.1 6.23,10.06 C48.1 | v17.1,12.94 17.03,12.87 C65.1 16.41,12.86 R28.1
  Top 0.12: RESET.1 14.51,33.61 v14.77,33.34 | 18.46,9.8 17.87,9.21 17.84,9.21 RF.2@2 | U8.9 6.48,17.59 | 6.48,17.59 5.79,17.59 U8.10 | v6.51,17.67 6.48,17.69 6.48,17.59 | RF1.2@2 7.23,6.49 v7.79,6.96 | RF1.2@1 5.69,9.01 v5.52,9.11 | C63.1 18.46,9.8 | 18.46,9.8 v19.15,10.13 | DEBUG.5 8.11,41.15 | 8.11,41.15 8.04,41.14 | 8.11,41.15 v8.28,40.55 | U3.P$2 11.54,37.34 v12.11,37.32 | C35.2 15.22,46.03 v15.56,46.05 | v18.7,40.68 18.51,40.88 BAT.1 | U4.49 13.32,13.89 v13.51,13.71 | U4.49 10.46,12.51 v10.33,12.61 | U4.49 10.56,11.13 v10.99,11.27 | C52.1 7.47,9.13 v7.8,8.66 9.02,8.71 | C72.1 12.93,7.85 v12.65,7.85 12.43,7.85 C70.1 12.24,8.73 C71.1 12.26,8.8 v12.02,8.98 | C51.1 9.01,8.77 v8.99,8.77
  Top 0.15: R35.2 v7.41,46.9 v7.42,46.89 | 18.6,44.43 v18.65,44.38 | BUTTON.3 4.81,32.51 v3.74,32.52 | v8.36,31.51 8.42,32.44 BUTTON.4 8.67,32.87 v8.67,33.36 | C64.1 18.52,15.08 v19.13,15.3 | C37.2 13.26,42.13 | RF.2@1 16.44,6.5 v16.6,6.98 | RESET.2 19.27,33.54 v19.19,33.31 | DEBUG.3 8.76,39.88 v8.28,40.55 | DEBUG.9 9.18,44.01 v9.18,44.41 | USB.4 10.78,45.9 v10.59,45.72 10.52,45.72 10.13,46.11 USB.5 | C25.1 7.96,36 8.06,36 8.09,36.03 8.1,36.02 8.1,35.99 | v9.33,37.6 8.82,37.28 v8.73,37.08 | C25.1 7.93,36.05 8.04,35.94 | C53.1 7.34,11.32 v7.48,11.5 | C56.1 6.09,13.3 v5.99,13.2 | Y3.2 4.57,11.82 v4.43,12 | v8.06,37.62 7.91,37.68 C25.1 | LED1.2 17.43,49.52 v17.82,49.13 | C58.1 15.17,17.25 v14.83,17.55 | C66.1 6.17,14.93 5.84,14.93 5.78,14.87 C49.2 | U4.49 11.94,11.77 v11.97,11.74
  Top 0.152: HEAD1.P$13 HEAD1.13
  Top 0.2: 8.04,41.14 7.9,41 7.8,41.07 7.21,40.48 v6.82,40.6
  Top 0.5: v3.76,34.73 3.2,35.29 2.98,35.29 1.71,36.56 1.71,37.25 2.53,38.07 2.65,38.07 2.65,37.89 3.61,36.93 3.61,36.08 v3.73,35.96
  Top 0.6: 17.64,6.46 17.82,6.46 17.84,6.48 RF.2@1
  Top 0.8: ANT1.GND 18.05,6.36 v18.1,6.22
  Route4 0.12: v5.87,24.93 5.87,25.38 5.67,25.58 5.67,28.11 v5.48,28.3 | v17.58,26.44 17.29,26.73 17.29,27.8
  Route4 0.15: v14.87,29.53 14.87,25.93 15.32,25.48 15.68,25.48 16.18,25.98 | 16.46,32.23 v16.45,32.24
  Bottom 0.11: C6.1 9.22,17.62 v9.12,17.7 | C18.2 7.3,17.67 v6.51,17.67 | 8.38,30.97 8.37,30.99 8.37,31.42 8.36,31.43 | 4.18,20.76 3.92,20.5 3.92,20.46 | U5.4 18.83,16.99 19.16,16.75 | 19.31,16.5 19.16,16.75 | 19.16,16.75 v19.15,16.43 | v3.1,25.67 3.49,24.95 C13.2 C43.2
  Bottom 0.12: 14.81,33.39 v14.77,33.34 | v8.67,33.36 9.08,34.18 C39.1 | 15.07,9.97 v14.78,10.36 14.7,10.38 15.04,10.1 | 12.7,7.54 C22.2 | C20.2 4.71,17.51 Y2.2 | C18.2 7.58,17.4 C33.2 | C19.1 4.18,20.76 | 3.92,20.46 v3.94,20.46 | 9.83,22.26 9.85,22.25 9.85,22.22 | 9.85,22.21 9.85,22.22 | 9.85,22.22 U1.P$77 | v5.52,9.11 v6.29,9.06 | v9.18,44.41 9.47,43.8 C46.2 9.5,43.7 9.45,43.7 9.46,43.71 9.55,43.71 9.56,43.7 10.51,43.7 C40.1 | v12.11,37.32 11.53,37.35 v11.55,37.3 | C42.2 11.87,40.06 v11.97,40.07 | Q1.2 18.7,38.81 v18.7,40.68 | C3.1 10.53,11.01 v10.99,11.27
  Bottom 0.15: v18.65,44.38 18.65,43.74 | C47.2 4.12,35.64 v3.73,35.96 | C16.1 4.25,28.97 v3.75,28.97 | 8.38,30.97 C17.1 | 8.36,31.43 8.35,31.6 v8.36,31.51 | C44.1 8.06,33.29 v8.08,33.36 | v9.44,21.38 9.53,21.25 U1.P$F23 9.58,20.63 9.58,20.6 9.63,20.56 9.63,19.64 9.18,19.19 C5.1 | C45.2 11.12,18.24 v11.25,18.52 | C32.1 17.35,23.49 v17.37,23.48 | 16.27,6.54 v16.6,6.98 | 7.1,33.56 v7.12,33.57 | v21.35,41.75 21.24,41.86 18.75,41.86 Q4.2 18.7,41.3 v18.7,40.68 | C39.1 9.87,34.29 | 9.87,34.29 9.88,34.3 | 9.87,34.29 C38.1 | C42.2 11.34,40.28 10.57,40.28 | 10.57,40.28 10.58,40.29 C41.2 | 10.57,40.28 10.28,40.57 v9.47,40.56 | U5.9 U5.10 17.26,17 17.27,16.99 U5.4 | 17.29,19.02 U5.9 | U5.9 17.26,19.58 v17.31,19.8 17.31,20.39 C8.1 | 9.18,16.48 C6.1 | v8.73,37.08 8.17,36.95 C59.1 8.21,37.09 v8.06,37.62 | U1.P$75 9.85,24.64 9.85,24.7 9.66,24.89 9.62,24.89 9.43,25.08 9.42,25.08 9.19,25.31 8.84,25.31 8.46,24.93 U1.P$B7 8.1,24.93 7.85,25.18 v7.5,25.18 v7.49,25.19 7.19,24.93 v5.87,24.93 5.65,24.83 C43.2 | C24.1 14.98,33.57 14.8,33.39 14.81,33.39 | C4.1 C21.1 12.98,28.99 v12.53,29.45 | C9.1 14.95,29.45 v14.87,29.53 | v12.91,12.27 13.01,12.32 12.88,12.31 12.51,12.11 U$2.P$8 | U$2.P$2 12.38,11.01 v12.48,10.89 | U$2.P$7 11.14,11.33 v10.99,11.27
  Bottom 0.2: U6.P$5 8.88,43.16 v8.89,43.17 | C12.1 5.8,27.98 v5.48,28.3 | C15.1 7.87,28.59 v7.7,28.42
  Bottom 0.25: U6.P$2 U6.P$7
  Bottom 0.5: v3.76,34.73 3.15,35.34 2.8,35.34 1.52,36.62 1.15,36.62 1.15,36.71 HEAD1.13
  other vias: 13.89,40.81 5.59,5.77 19.12,30.75 10.66,5.85 8.42,8.62 10.59,8.62 16.15,8.77 19.88,9.6 0.69,46.33 5.99,45.71 8.61,50.19 8.65,45.46 14.13,50.22 11.83,49.83 5.54,50.3 3.74,30.79 2.65,32.91 6.82,31.99 3.91,21.66 4.01,18.99 19.12,29.18 3,14.69 2.93,12.81 3.14,10.01 2.74,6.11 3.73,8.51 4.44,8.12 4.49,7.23 12.67,5.8 7.08,6.97 14.54,5.83 11.87,14.04 19.18,13.17 19.17,12.27 19.82,8.28 19.86,6.74 19.98,5.77 18.95,7.48 19.16,11.32 18.64,24.85 15.33,47.23 19.19,27.57 3.15,7.51 19.02,26.05 21.5,38.97 21.34,40.02 21.35,37.95 16.2,41.92 18.7,39.27 16.87,39.82 8.85,40.55 8.16,43.17 21.84,45.74 19.49,45.68 17.26,45.98 18.38,50.13 4.35,50.31 6.77,50.39 10.59,44.45 19.11,31.95 7.25,20.18 6.08,20.16 13.62,5.82 8.88,43.74 7.29,45.8 3.01,42.83 5,6.49 6.07,6.49 4.77,8.83 7.04,8.7 11.71,5.84 9.34,5.95 8.05,5.95 4.03,6.04 12.84,33.82 13.23,34.85 12.8,34.51 11.95,39.43 10.96,37.32 14.31,39.79 15.18,7.36 17.32,6.74 19.15,5.78 16.87,8.76 17.55,8.98 18.38,8.87 15.04,40.8 9.41,33.69 3.95,44.91 10.33,13.66 12.05,13.36 19.12,14.26 16.29,15.01 16.89,40.78 14.79,7.97 17.57,24.84 16.3,26.98 16.1,25.93 16.51,5.77 14.86,16.84 2.65,30.69 2.64,28.56 8.83,6.85 9.34,7.2 9.88,7.57 10.18,6.71 10.36,8.01 14.07,8.68 18.89,8.27 18.44,6.87 15.8,9.28 6.33,10.24 13.77,6.45 16,6.76 16.33,6.3 14.8,18.46 10.34,10.94 13.53,11.9 3.51,46.14 17.67,17.77 4.2,13.24 6.54,11.23 3.1,11.18 4.91,11.22 4.2,14.47 3.85,27.02 3.41,41.58 16.19,29.5 14.34,31.83 18.15,31 17.94,47.4 16.79,45.36 4.57,45.68
  pour Bottom (isolate 0.2, no thermals): -1.57,51.48 24.16,51.48 24.16,35.47 20.29,35.47 20.29,5.5 2.45,5.5 2.43,35.97 -0.48,35.97 -0.46,37.68 2.42,37.68 2.43,45.72 -1.58,45.74 -1.58,51.33 -1.59,51.3
  pour Top (isolate 0.2, no thermals): -1.6,51.48 24.13,51.48 24.13,35.47 20.26,35.47 20.28,5.5 2.42,5.5 2.4,35.97 -0.51,35.97 -0.5,37.7 2.38,37.7 2.4,45.72 -1.6,45.74 -1.6,51.33 -1.62,51.3
  pour Route4 (isolate 0.2, no thermals): -1.6,51.48 24.13,51.48 24.13,35.47 20.9,35.47 20.9,5.5 2,5.5 2,35.65 -0.48,35.65 -0.39,38 2.5,38 2.4,45.72 -1.6,45.74 -1.6,51.33 -1.62,51.3
  pour Route3 (isolate 0.152, no thermals): -1.6,51.48 24.13,51.48 24.13,35.47 20.9,35.47 20.9,5.5 2,5.5 2,35.59 -0.49,35.59 -0.47,38.06 2.42,38.06 2.4,45.72 -1.6,45.74 -1.6,51.33 -1.62,51.3
  cutout Top: 9.75,14.77 14.39,14.77 14.39,10.75 14.39,10.29 9.69,10.29 9.69,14.75 9.71,14.75
  cutout Bottom: 8.68,20.02 11.15,20.02 11.15,18.79 11.03,18.79 11.03,18.3 11.02,17.56 10.83,17.55 9.39,17.56 9.39,17.9 8.66,17.9 8.66,19.89
  pour Route15 (isolate 0.152, no thermals): -1.6,51.48 24.13,51.48 24.13,35.47 20.9,35.47 20.9,5.5 2,5.5 2,35.59 -0.49,35.59 -0.47,38.06 2.42,38.06 2.4,45.72 -1.6,45.74 -1.6,51.33 -1.62,51.3
  pour Route2 (isolate 0.15, no thermals): -1.6,51.48 24.13,51.48 24.13,35.47 20.9,35.47 20.9,5.5 2,5.5 2,35.59 -0.49,35.59 -0.47,38.06 2.42,38.06 2.4,45.72 -1.6,45.74 -1.6,51.33 -1.62,51.3
GREEN  (via drill 0.2 pad 0.4)
  Top 0.15: v13.09,30.22 13.06,30.22 13.06,30.46 12.8,30.72 12.18,30.72 11.95,30.95 R7.1
  Route4 0.15: v13.09,30.22 13.51,29.8 13.51,28.7 13.66,28.55 13.66,25.19 13.76,25.09 v13.76,24.91
  Bottom 0.12: 13.81,24.45 13.76,24.45 U1.P$AC9
  Bottom 0.15: 13.76,24.45 v13.76,24.91
HOST_WAKE  (via drill 0.2 pad 0.4)
  Top 0.12: U4.15 14.88,10.93 15.25,10.56 15.89,10.56 16.3,10.96 v16.3,11.2 v16.3,11.21
  Route2 0.12: v11.12,25.34 11.15,25.34 11.22,25.28 12.58,25.28 12.95,25.64 13.74,25.64 14.44,24.95 16.59,24.95 v16.7,24.85
  Route4 0.11: 15.76,22.6 15.76,24.34 16.26,24.85 v16.7,24.85
  Route4 0.12: 15.76,22.6 15.47,22.3 15.47,21.96 15.91,21.53 15.91,19.62 15.81,19.53 15.81,17.81 15.56,17.56 15.56,15.56 15.81,15.31 15.81,14.35 16.31,13.86 v16.31,11.21 v16.3,11.21
  Bottom 0.12: v16.3,11.21 16.3,12.15 R36.2
  Bottom 0.15: U1.P$M2 11.03,25.47 v11.12,25.34
MISO  (via drill 0.2 pad 0.4)
  Top 0.152: HEAD1.P$4 HEAD1.4
  Route2 0.12: v8.71,22.71 4.17,22.71 3.81,22.36 v2.87,22.36
  Route4 0.12: v2.87,22.36 2.68,22.17 2.68,21.01 | 2.68,21.01 | 2.68,21.01 2.68,18.84 2.23,18.38 2.23,15.73 1.27,14.77 HEAD1.4
  Bottom 0.15: U1.P$B15 8.42,22.93 v8.71,22.71
MODE  (via drill 0.2 pad 0.4)
  Top 0.15: BUTTON.1 5.65,34.04 | 5.65,34.04 7.66,34.04 | 7.66,34.04 BUTTON.2 | 7.66,34.04 7.65,34.04 7.65,33.38 7.28,33.01 7.28,31.38 8.11,30.55 11.04,30.55 v11.37,30.23 | HEAD1.14 2.2,39.37 3.71,37.86 4.93,37.86 5.45,37.35 5.45,36.01 5.66,35.8 5.66,34.05 5.65,34.04
  Top 0.152: HEAD1.P$14 HEAD1.14
  Route4 0.12: v12.47,26.19 12.47,26.23 11.37,27.33 v11.37,30.23
  Bottom 0.15: U1.P$T2 v12.47,26.18 v12.47,26.19
MOSI  (via drill 0.2 pad 0.4)
  Top 0.152: HEAD1.P$5 HEAD1.5
  Route4 0.11: v2.73,23.14 2.75,23.13 2.75,22.87 2.42,22.54 2.42,21.12 | 2.42,21.12 | 2.42,21.12 2.42,18.95 1.27,17.8 HEAD1.5
  Bottom 0.11: U1.P$A16 6.61,22.68 6.21,23.08 4.11,23.08 3.92,23.28 2.86,23.28 v2.73,23.14
N$1
  Top 0.11: 4.92,13.38 5.02,13.29 5.02,13.46 4.8,13.67 4.85,13.72 Y3.1
  Top 0.12: U4.44 8.71,12.33 arc-60 8.49,12.54 8.48,12.55 arc60 8.28,12.75 6,12.75 arc-45 5.31,13.04 5.27,13.08 arc-45 Y3.1 arc-45 5.03,13.65 C49.1
  Top 0.152: 4.92,13.38 4.92,13.57
N$2
  Bottom 0.12: 9.96,19.45 10.15,19.26
  Bottom 0.15: U1.P$H23 9.93,20.58 9.93,19.37 10.1,19.2 | 10.1,19.2 10.12,19.22 10.14,19.22 10.15,19.23 10.15,19.26 | C5.2 10.12,19.18 10.1,19.2
  Bottom 0.2: 10.12,19.22 10.12,19.18 C5.2
  Bottom 0.3: L1.1 10.14,18.46
  Bottom 0.55: C5.2 10.14,18.46
N$3
  Bottom 0.152: C7.2 10.34,15.62 10.34,15.66
  Bottom 0.4: L1.2 10.14,17.17 10.13,17.27 | C6.2 10.14,16.44 10.14,16.65
  Bottom 0.45: L1.2 10.16,17.32 10.14,17.24 | C6.2 10.16,16.39 10.17,16.39
  Bottom 0.55: 10.13,17.27 10.14,17.17
  Bottom 0.6: 10.34,15.66 arc-23 10.14,16.65 10.13,17.27
N$4
  Bottom 0.12: 5.3,29.17 5.46,29.17 5.46,29.26 8.54,29.26 9.12,28.68
  Bottom 0.13: U1.P$D2 9.03,26.45 9.12,26.54 9.12,28.68
  Bottom 0.15: 4.44,30.16 4.44,30.34 4.45,30.35 4.45,30.42 Y1.2 4.68,29.94 5.46,29.17 5.44,29.15 C16.2
N$5  (via drill 0.2 pad 0.4)
  Route4 0.15: v8.25,18.89 7.73,19.41 7.73,21.88 7.1,22.51 7.1,24.76 6.88,24.98 v6.88,25.39
  Bottom 0.15: 9.24,20.11 9.24,20.14 U1.P$E24 8.66,19.56 8.66,18.52 C33.1 8.4,18.34 8.28,18.47 8.28,18.86 v8.25,18.89
  Bottom 0.2: U1.P$B5 8.09,25.43 7.63,25.89 5.61,25.89 C43.1 | C13.1 4.56,25.8 | C43.1 5.68,25.8 6.09,25.39 6.68,25.39 6.89,25.52 v6.88,25.39 | C13.1 4.61,26.72 L4.2 | C43.1 C13.1
N$6
  Bottom 0.2: L4.1 5.05,27.68 5.6,27.13 L3.2
N$7
  Bottom 0.2: U1.P$B3 7.62,26.6 6.79,26.6 6.63,26.75 L3.1
N$8
  Bottom 0.2: U1.P$C1 8.78,27.31 C15.2
N$9
  Bottom 0.13: U1.P$F2 9.43,26.29 9.43,28.78 8.34,29.86 C17.2 7.56,30.01 Y1.1
N$10  (via drill 0.3 pad 0.6)
  Top 0.15: 16.26,7.79 RF.1 16.26,7.69 16.27,7.7
  Top 0.55: 16.26,7.79 v16.04,7.9
  Bottom 0.15: v16.04,7.9 C2.1 16.26,7.79 | C54.1 15.55,8.22 15.53,8.26
  Bottom 0.6: C2.1 15.53,8.26
N$11
  Bottom 0.15: U1.P$A23 5.49,20.68 5.45,20.73 | 5.45,20.73 C19.2 | Y2.3 5.45,20.52 5.45,20.73 | 5.45,20.78 5.45,20.73
N$12
  Bottom 0.15: C18.1 7.66,18.42 7.66,19.04 8.75,20.13 8.75,20.4 U1.P$D23
N$13
  Bottom 0.15: C22.1 13.33,8.24 13.39,8.24 | C10.2 12.87,8.92
  Bottom 0.55: 13.79,7.7 C11.2
  Bottom 0.6: 13.79,7.7 13.39,8.24 12.87,8.92
N$14
  Bottom 0.15: Q4.3 17.08,39.04 Q1.1 17.22,38.48 18.37,37.33 18.37,35.92 18.19,35.73 14.62,35.73 14.08,36.27 R19.1
N$15
  Bottom 0.15: 6.32,18.41 Y2.1 6.51,18.52 6.59,18.45 6.59,18.49 U1.P$B24 | 6.32,18.41 5.53,17.62 5.53,17.36 5.52,17.37 C20.1 | 6.65,18.55 6.46,18.55 6.32,18.41
N$16
  Bottom 0.15: 11.42,12.71 arc1 U$2.P$5
  Bottom 0.152: C7.1 10.69,14.67 10.73,14.63
  Bottom 0.6: 10.73,14.63 11.42,12.71
N$17
  Bottom 0.12: 11.7,10.78 11.7,10.99 U$2.P$3
  Bottom 0.15: U$2.P$3 11.79,11.22 11.63,10.98 11.8,10.87 11.9,11.08 11.9,10.86 11.95,11.03 11.94,10.7 | C10.1 12.24,9.82 | 11.7,10.78 11.74,10.76
  Bottom 0.6: 12.24,9.82 11.74,10.76 11.75,10.83
N$18
  Top 0.15: USB.1 12.84,46.91 12.84,47.21
  Top 0.152: D6.2 15,45.27
  Top 0.5: F1.P$1 13.75,45.27 14.67,45.26 | 15,45.27 14.67,45.26 | 14.67,45.26 14.25,44.97
  Top 0.6: F1.P$1 12.84,45.82 12.84,47.21
N$19
  Top 0.15: R14.2 16.48,46.95 16.48,47.76 16.73,48.02 LED1.1
N$20
  Top 0.12: U4.45 9.02,11.98 8.42,12.05 arc-10 8.06,12.16 R25.1
N$21
  Bottom 0.15: Q3.1 14.01,37.84 14.56,37.36 14.56,36.22 14.74,36.03 17.28,36.03 Q1.3 17.61,36.61 17.61,37.03 17.13,37.51 R21.2
N$22
  Top 0.12: U4.27 13.51,15.6 13.72,15.81 13.72,16.21 13.29,16.65 13.29,17.05 13.68,17.45 13.68,17.79 13.37,18.1 TP8.P$1
N$23
  Top 0.15: R8.2 10.25,32.73 10.25,33.4 RGB.RED
N$24
  Top 0.12: U4.47 8.9,11.28 8.35,10.73 | 8.35,10.73 C55.2 | R26.1 8.34,10.74 8.35,10.73
N$25  (via drill 0.2 pad 0.4)
  Top 0.11: U4.40 8.97,13.73 8.83,13.87 8.83,14.21 8.61,14.43 v8.12,14.43 v8.11,14.43
  Bottom 0.11: R34.1 7.68,14.26 7.93,14.26 v8.11,14.43
N$26
  Top 0.15: RGB.BLUE 11.98,32.38 11.93,32.34 11.93,32.26 11.97,32.3 13.03,32.3 R5.2
N$27
  Top 0.12: 10.79,31.43 10.79,31.45 | 10.77,31.42 10.76,31.42
  Top 0.15: RGB.GREEN 10.88,32.45 10.8,32.36 10.8,31.42 | R7.2 10.8,31.24 10.8,31.42 | 10.8,31.42 10.79,31.43 | 10.8,31.42 | 10.8,31.42 10.77,31.42
N$28
  Bottom 0.15: U1.P$A18 6.86,22.18 6.69,22.18 6.3,22.58 5.48,22.58 5.47,22.57 C29.2
N$29
  Bottom 0.15: U1.P$AC5 13.88,25.54 13.88,27.89 C4.2
N$30
  Bottom 0.12: 11.58,19.22 C45.1
  Bottom 0.15: U1.P$N24 11.28,19.9 11.56,19.62 11.56,19.24 11.58,19.22
N$31
  Top 0.15: U3.P$4 12.62,38.93 R17.1
N$32
  Top 0.15: C50.2 8.85,7.86 | C30.1 8.3,7.8 8.26,7.84
  Top 0.5: 8.26,7.84 7.94,7.84
  Top 0.55: RF1.1 7.94,7.84 8.51,7.83 8.85,7.86 8.96,7.9
  Top 0.65: RF1.1 6.66,7.84 6.63,7.87
N$33
  Bottom 0.12: 12.9,11.46 12.52,11.56 U$2.P$1
  Bottom 0.15: 12.62,11.68 12.84,11.68 12.97,11.65 12.54,11.65 12.88,11.37 12.74,11.45 U$2.P$1 12.57,11.4 12.78,11.32 12.84,11.26
  Bottom 0.6: C1.2 12.9,11.46
N$34  (via drill 0.2 pad 0.4)
  Top 0.11: U4.41 8.89,13.38 8.43,13.94 v8.37,13.94
  Bottom 0.11: v8.37,13.94 7.62,13.37 R42.1
N$35
  Top 0.15: R10.1 5.02,47.88 5.02,47.81 | 5.02,47.81 4.95,47.74 | 5.02,47.81 5.03,47.82 6.12,47.82 6.12,48 CNG.2
  Top 0.2: R32.2 5.02,47.81 5.02,47.88
N$36  (via drill 0.2 pad 0.4)
  Top 0.11: U4.39 9.15,14.08 9.15,14.07 9.15,14.66 v9.16,14.68
  Bottom 0.11: v9.16,14.68 9.22,14.73 9.22,15.37 9.06,15.53 7.98,15.53 7.67,15.84 R44.1
N$37
  cutout Route15: 9.11,19.73 10.9,19.73 11.1,19.73 11.09,16.6 16.04,8.87 18.81,8.88 18.81,6.91 16.49,6.91 16.49,5.01 14.58,5.01 10.63,10.43 8.66,16.43 8.66,19.66 8.66,19.73
  cutout Route4: 9.11,19.73 10.9,19.73 11.1,19.73 11.09,16.6 16.04,8.87 18.81,8.88 18.81,6.91 16.49,6.91 16.49,5.01 14.58,5.01 10.63,10.43 8.66,16.43 8.66,19.66 8.66,19.73
  cutout Route15: 9.11,19.73 10.9,19.73 11.1,19.73 11.09,16.6 16.04,8.87 18.81,8.87 18.81,6.91 16.49,6.91 16.49,5.01 14.58,5.01 10.63,10.42 8.66,16.43 8.66,19.66 8.66,19.73
N$38
  Bottom 0.15: 9.74,38.86 9.74,39.17 U6.P$1
  Bottom 0.5: 9.66,39.47 9.8,39.47 10.77,38.5 10.93,38.5 9.98,39.45 9.83,39.45
  Bottom 0.6: L5.1 10.1,38.51 9.49,38.51 9.49,38.96 9.57,39.03 9.57,39.47 9.66,39.47 9.68,39.49 9.74,39.42 9.74,38.86
N$39
  Top 0.11: C61.2 7.54,10.13 7.45,10.18
  Top 0.12: 9.41,10.9 U4.48 | 9.26,10.93 9.02,10.93 8.8,10.71 8.8,10.34 8.59,10.12 C55.1 7.69,10.12 C61.2 | R26.2 arc45 7.05,10.58 7.45,10.18
  Top 0.15: 9.26,10.93 U4.48
N$40
  Top 0.15: U3.P$6 10.86,38.36
  Top 0.6: 11.44,40.95 11.11,40.61 11.11,39.65 | 11.11,39.65 11.07,39.61 | 11.11,39.65 11.11,39.66 11.12,39.66 D3.2 10.86,39.43 | 10.86,38.36 10.86,39.43 | 10.86,39.43 10.86,40.34 11.44,40.92 11.44,40.95 | C37.1 11.69,41.19 11.44,40.95
N$41
  Top 0.12: 10.71,9.71 10.71,9.26 10.7,9.26 10.62,9.35 10.55,9.41 10.36,9.6 10.36,9.72
  Top 0.15: 10.71,9.71 U4.4 10.71,10.03 10.68,10.01 | U4.3 10.36,9.72
  Top 0.152: U4.4 10.7,10 10.7,9.26
  Top 0.18: 10.55,9.41 10.55,9.56 10.45,9.66 10.45,10.29 10.44,10.3 10.45,10.31 10.6,10.31 10.6,9.59 10.62,9.57 10.62,9.45 10.61,9.44
  Top 0.3: 10.61,9.44 10.52,9.44 | 10.61,9.44 10.63,9.45 | 10.61,9.34 10.61,9.44 | 10.62,9.35 10.61,9.34 | 10.61,9.34
  Top 0.4: 10.62,9.35 10.79,9.18 10.82,9.18 10.84,9.16 11.09,9.16 11.36,8.89 | 11.36,8.89 11.37,8.88 C71.2 | L8.2 11.36,8.89
N$42
  Bottom 0.15: C1.1 13.93,10.16 | C54.2 14.76,9.17
  Bottom 0.6: 14.76,9.17 C57.1 13.93,10.16
N$43
  cutout Top: 15.26,8.56 15.26,7.15 17.32,7.15 17.31,8.56
N$46
  Top 0.18: U4.25 14.21,15.37 14.42,15.57 15.41,15.57 15.42,15.57 15.8,15.57 15.86,15.62 TP7.P$1
N$47
  Top 0.15: U4.18 15.56,11.98 15.52,11.94 R28.2
N$48
  Top 0.12: Y4.2 18.08,11.18 18.05,11.21 17.83,11.21 | 17.52,11.16 17.47,11.21 17.83,11.21 | U4.12 13.51,9.46 13.87,9.1 14.56,9.1 15.47,10.01 16.16,10.01 16.61,10.46 17.46,10.46 17.52,10.46 C63.2 17.41,10.46 17.85,10.89 17.85,11.19 17.83,11.21
N$49
  Top 0.12: U4.13 13.86,9.5 13.98,9.38 14.45,9.38 15.36,10.28 16.05,10.28 16.85,11.08 16.85,12.08 17.54,12.78 17.54,13.97 | 17.54,13.97 18.07,13.97 Y4.1 17.53,14.29 17.53,14.88 17.46,14.88 C64.2 | 17.54,13.97 17.54,14.01 17.52,14.03
N$50
  Top 0.11: 6.21,12 6.39,12.17 6.39,12.06 6.42,12.02
  Top 0.12: 6.21,12 Y3.3 | R25.2 7.42,12.19 7.45,12.15 6.49,12.15 | 6.41,12.02 6.41,12.07 6.49,12.15 | C48.2 6.49,12.15
  Top 0.15: 6.34,11.79 6.41,11.97 6.41,12.02 6.42,12.02
N$51
  Top 0.11: 15.12,13.55 15.05,13.47 15.05,13.21 14.87,13.03 U4.21
  Top 0.12: TP6.P$1 15.57,14 15.12,13.55 15.07,13.49
N$52
  Top 0.15: 10.03,9 10.04,9.01 9.98,9.06 C51.2
  Top 0.18: U4.2 10.01,9.32 9.91,9.22 C51.2 | C50.1 9.62,8.3
  Top 0.55: 9.62,8.3 arc70 9.98,9.06
N$53
  Top 0.11: 15.51,11.14 TP5.P$1
  Top 0.12: U4.17 15.03,11.63 15.51,11.14
N$54  (via drill 0.2 pad 0.4)
  Top 0.11: U4.38 9.55,15.12 v8.79,15.12
  Bottom 0.11: R43.1 7.74,15.12 v8.79,15.12
N$55
  Top 0.15: RGB.CA 11.9,34.11 11.9,34.63 11.68,34.85 10.17,34.85 10.09,34.77 9.74,34.77 | 9.74,34.77 6.67,34.77 6.33,35.11 R4.1 | R23.2 9.72,34.76 9.74,34.77
N$56
  cutout Route2: 4.65,8.73 9.16,8.73 9.16,9.28 10.97,9.28 10.97,6.75 4.63,6.75 4.63,7.03 4.64,7.03
N$57
  cutout Top: 6.49,7.84 arc90 5.7,8.64 5.69,8.64 arc90 4.86,7.8 4.86,7.79 arc90 5.64,7.01 5.75,7.01 arc90 6.49,7.75 6.49,7.81
  cutout Top: 18.48,7.86 arc90 17.72,8.7 17.64,8.7 arc90 16.8,7.86 16.8,7.74 arc90 17.69,7.05 17.86,7.07 arc90 18.47,7.85 18.47,7.83
N$71  (via drill 0.2)
  Top 0.152: R2.1 11.5,44.24 11.5,43.89 v11.47,43.89 v11.46,43.89
  Route4 0.11: v11.46,43.89 11.6,43.76 11.6,41.39 11.67,41.32 15.34,37.66 15.34,26.07 v15.5,25.91
  Bottom 0.15: 14.36,25.18 14.53,25.18 15.25,25.91 v15.5,25.91
  Bottom 0.152: U1.P$AD6 14.36,25.18
N$72  (via drill 0.2, 0.2 pad 0.4)
  Top 0.15: R3.1 12,44.44 11.92,44.36 11.92,43.99 v12.02,43.9
  Route4 0.11: v15.75,26.43 15.6,26.58 15.6,37.77 11.96,41.41 11.91,41.46 11.86,41.5 11.86,43.69 12.05,43.87
  Route4 0.15: 12.05,43.87 v12.02,43.9
  Bottom 0.15: U1.P$AD4 14.6,25.68 15.35,26.43 15.72,26.43 | 15.72,26.43 15.72,26.42 | v15.75,26.43 15.72,26.43
N$74
  Bottom 0.15: C11.1 14.59,6.89 | C23.1 15.16,6.26
  Bottom 0.2: C11.1 14.61,6.87 | C23.1 15.21,6.28 15.21,6.26
  Bottom 0.55: ANT1.RF 15.69,5.44 15.68,5.55
  Bottom 0.6: 14.61,6.87 15.21,6.26 15.42,6 15.68,5.55
NFC1  (via drill 0.2 pad 0.4)
  Top 0.15: 10.24,48.94 10.26,48.92 v10.26,48.88
  Route4 0.12: v10.97,20.64 11.06,20.72 11.06,21.54 11.68,22.16 11.68,24.85 11.99,25.16 11.99,25.99 11.62,26.36 11.23,26.36 10.18,27.41 10.18,28.39 10.9,29.11 10.9,31.77 10.11,32.55 10.11,39.37 10.37,39.63 10.37,42.96 9.98,43.35 9.98,48.59 v10.26,48.88
  Bottom 0.11: U1.P$L24 10.78,20.45 v10.97,20.64
  Bottom 0.15: v10.26,48.88 10.24,48.9 NFC.2@1 NFC.2@2 13.77,48.93 R37.1
NFC2  (via drill 0.2 pad 0.4)
  Route4 0.12: v10.46,21.52 10.46,24.66 10.03,25.1 9.89,25.1 9.34,25.65 9.34,29.13 9.56,29.35 9.56,32.43 9.83,32.7 9.83,39.53 10.08,39.78 10.08,42.84 9.71,43.2 9.71,48.14 v9.46,48.39
  Bottom 0.11: v10.46,21.52 10.52,21.46 10.52,20.42 U1.P$J24
  Bottom 0.15: NFC.1 11.37,47.65 11.32,47.61 9.75,47.61 9.62,47.74 9.62,48.23 v9.46,48.39
  Bottom 0.152: R38.2 9.46,48.5 v9.46,48.39
RED  (via drill 0.2)
  Top 0.15: v9.01,31.36 8.99,31.38 9.19,31.19 R8.1
  Route2 0.12: v9.01,31.36 9.25,31.11 10.52,31.11 10.68,31.27 11.87,31.27 12.03,31.11 12.5,31.11 12.68,31.29 16.67,31.29 v16.75,31.38
  Bottom 0.15: U1.P$AD8 15.5,24.68 16.83,26.01 16.83,27.71 17.31,28.2 17.31,29.8 16.75,30.36 v16.75,31.38
RX  (via drill 0.2 pad 0.4)
  Top 0.152: HEAD1.P$3 HEAD1.3
  Route2 0.12: v10.92,28.05 10.46,28.05 10.25,27.85 2.75,27.85 v2.64,27.96
  Route4 0.12: HEAD1.3 1.95,12.1 1.95,13.27 2.3,13.62 2.3,15.36 2.51,15.57 2.51,18.24 2.98,18.71 2.98,21.89 3.03,21.94 3.04,21.94 3.36,22.26 3.36,22.52 3.15,22.72 3.15,24.39 3.34,24.57 3.34,24.95 3.34,25.01 3.11,25.23 2.76,25.23 2.42,25.57 2.42,27.8 2.59,27.96 v2.64,27.96
  Route15 0.11: 1.88,12.04 HEAD1.3
  Bottom 0.15: U1.P$N1 11.23,26.73 11.23,27.61 10.92,27.92 v10.92,28.05
SCK  (via drill 0.2 pad 0.4)
  Top 0.152: HEAD1.P$6 HEAD1.6
  Route4 0.11: v2.15,22.88 2.15,22.77 2.15,22.76 2.15,21.22 | HEAD1.6 2.15,19.93 2.15,21.22 | 2.15,21.22
  Bottom 0.11: U1.P$A14 6.48,23.18 6.3,23.36 4.21,23.36 3.9,23.67 2.67,23.67 2.15,23.14 v2.15,22.88
SCK/CLK
  Top 0.11: U4.31 12.11,15.44 12.02,15.53 12.02,17.34 R27.1
SCL  (via drill 0.2 pad 0.4)
  Top 0.152: HEAD2.P$2 HEAD2.2
  Route2 0.12: v10.05,25.62 10.08,25.65 10.08,25.84 10.46,26.22 11.86,26.22 12.24,26.6 13.55,26.6 14.66,25.5 16.25,25.5 16.36,25.6 19.96,25.6 v20.05,25.69
  Route4 0.11: v20.05,25.69 20.07,25.66 20.07,25.6
  Route4 0.12: 20.07,25.6 19.89,25.42 19.89,24.95 20.11,24.73 20.11,23.37 19.78,23.03 19.78,18.72 20.61,17.89 20.61,17.21 20.4,17 20.4,12.23 20.7,11.93 20.7,11.06 21.59,10.17 HEAD2.2
  Bottom 0.15: v10.05,25.62 10.03,25.51 U1.P$H2
SCS/CMD  (via drill 0.2 pad 0.4)
  Top 0.12: 7.64,19.14 7.66,19.16 7.66,19.22 7.78,19.34 9.24,19.34 9.59,18.99 11.39,18.99 12.46,17.91 12.46,16.39 | 12.46,16.39 U4.30 | v12.43,16.39 12.46,16.4 12.46,16.39
  Top 0.15: 7.64,18.76 U8.1 7.64,19.14
  Bottom 0.12: v12.43,16.39 12.43,16.46 12.45,16.48 R29.1
SD_CLK
  Top 0.11: U8.6 6.04,16.45 6.09,16.5 | 10.95,17.39 10.99,17.43 R27.2
  Top 0.12: 10.95,17.39 10.83,17.28 6.88,17.28 6.32,16.72 6.09,16.5